# EAGLE board Spartan Edge Accelerator Board v1.0 (EAGLE 6.4), part 1 of 3
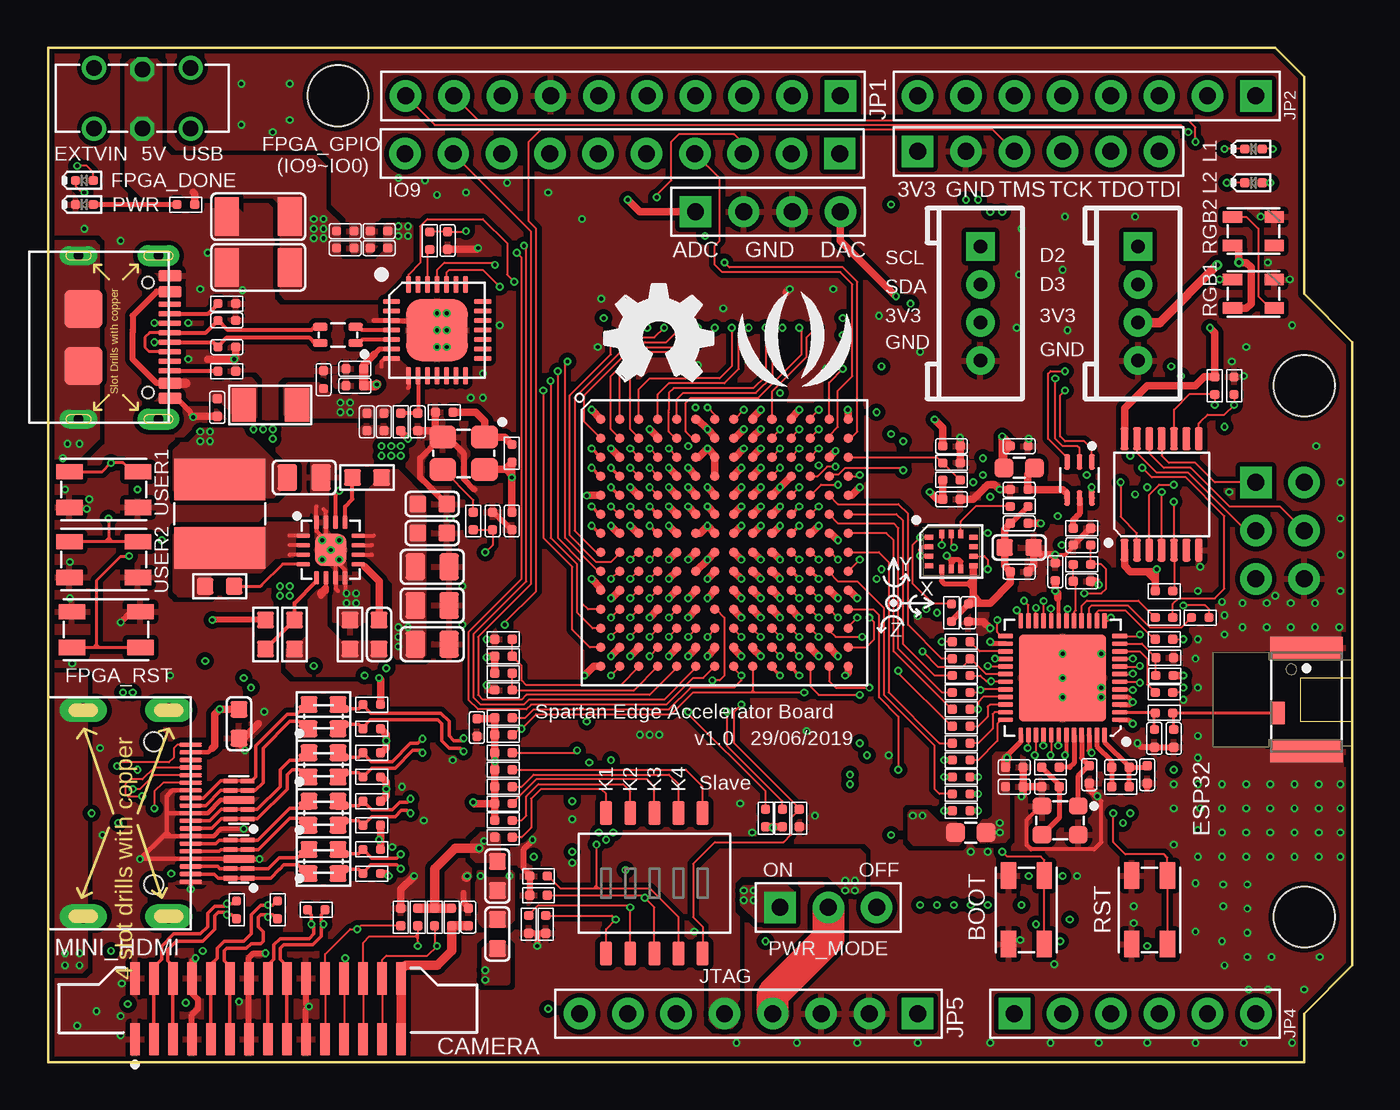
[diagram p8: board, top side]
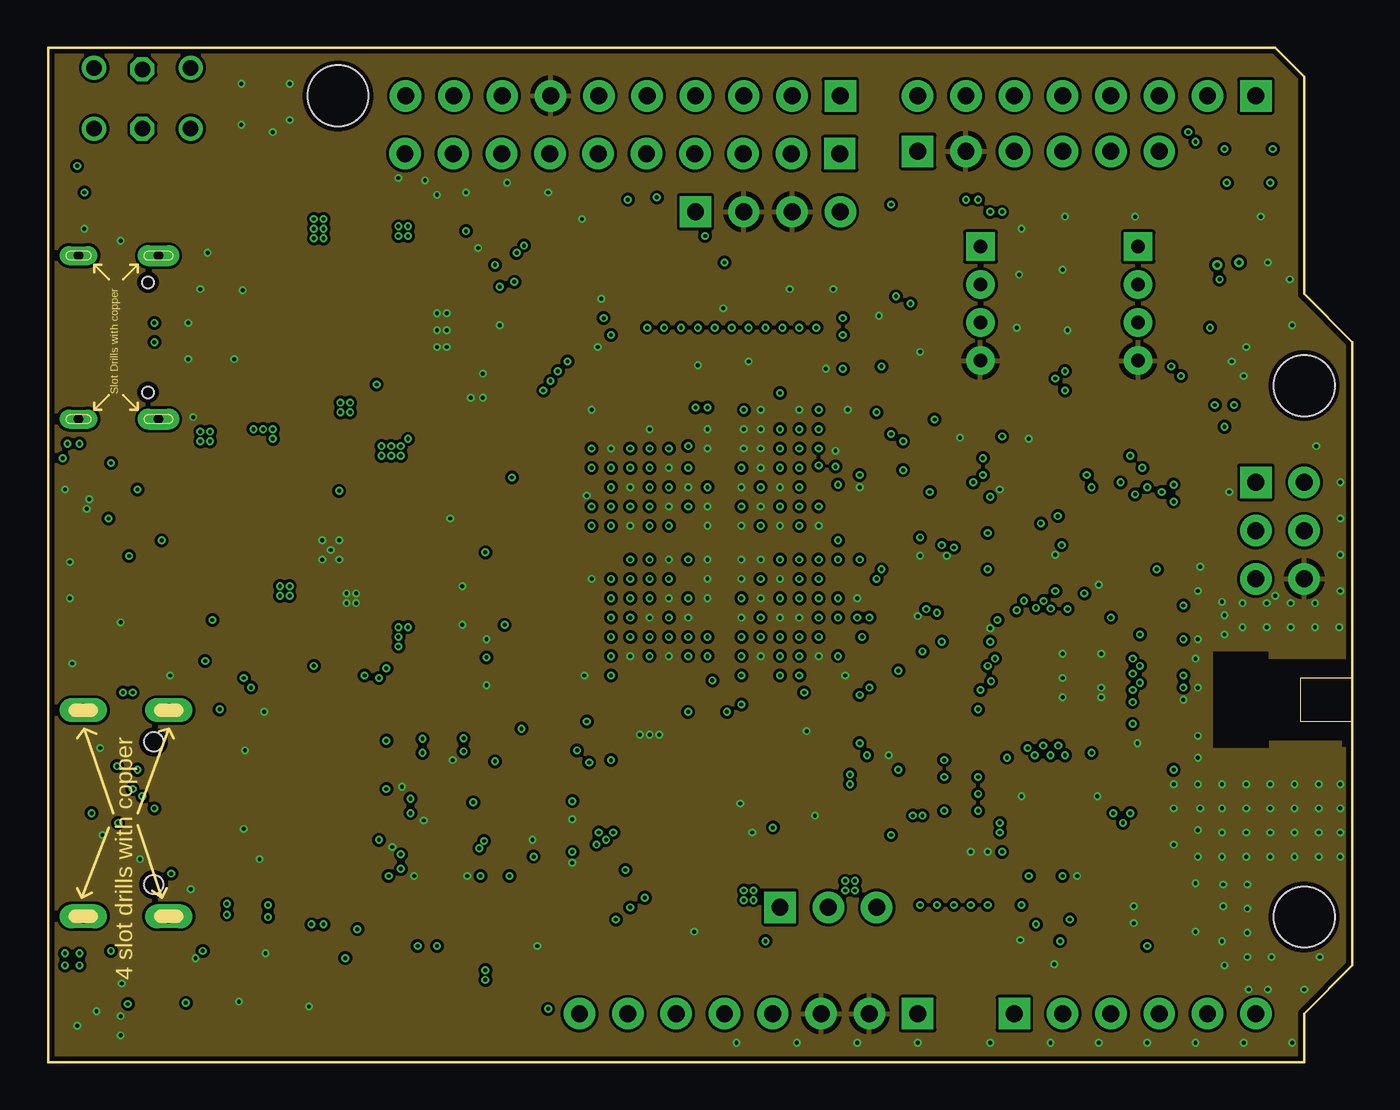
[diagram p9: board, inner layer GND2]
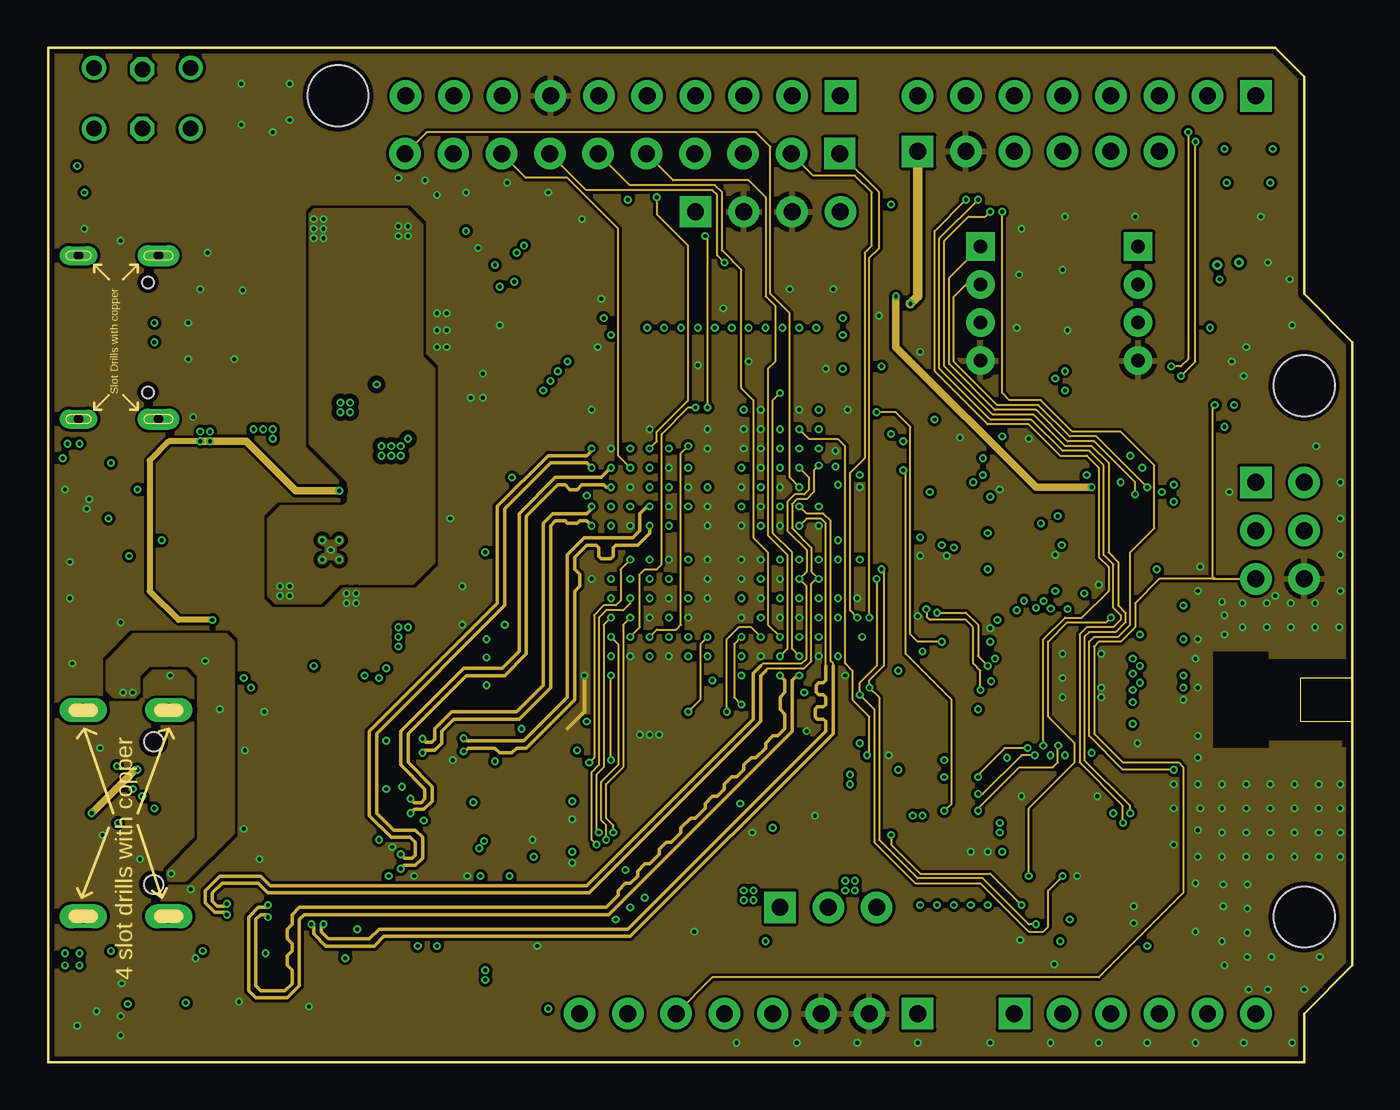
[diagram p10: board, inner layer Route3]
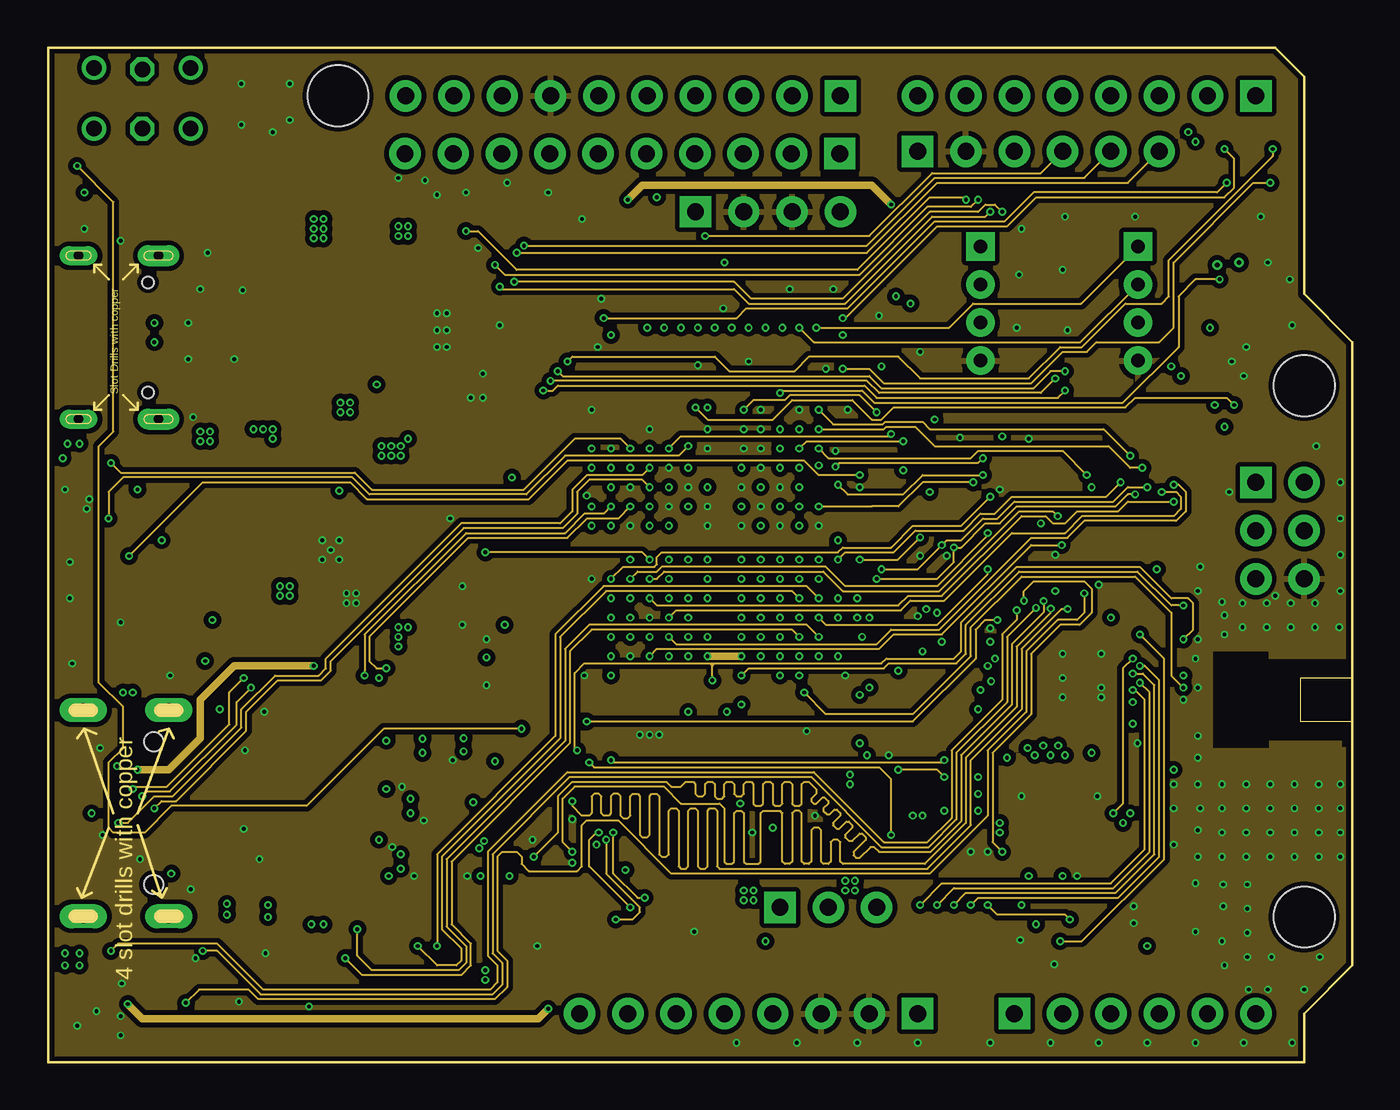
[diagram p11: board, inner layer Route14]
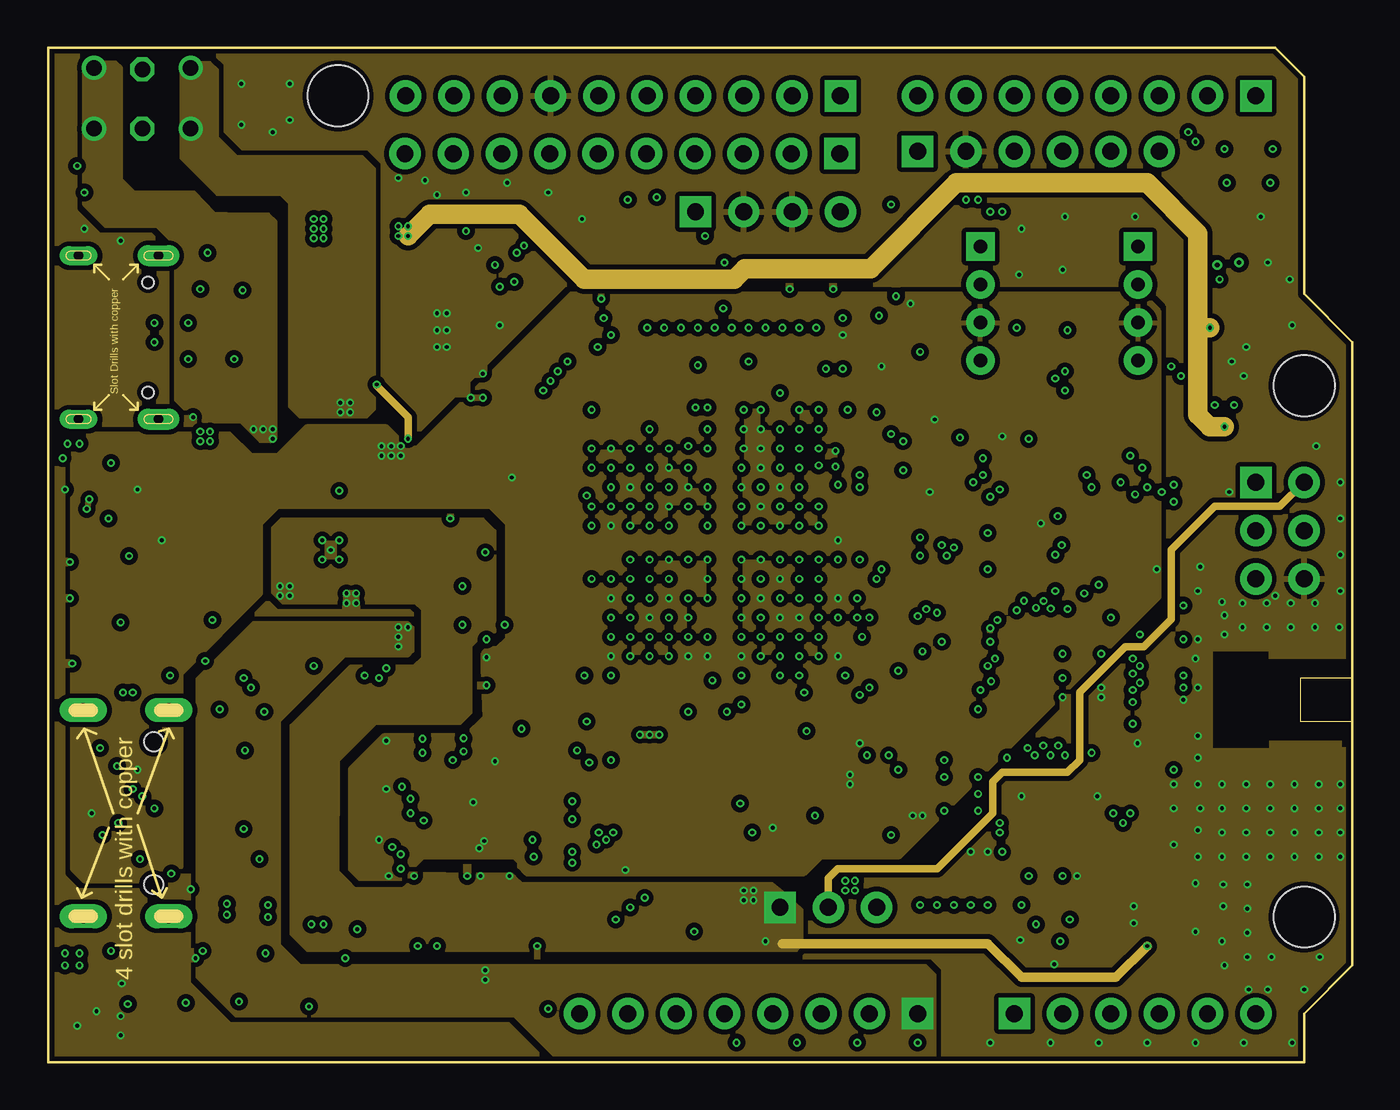
[diagram p12: board, inner layer Route15]
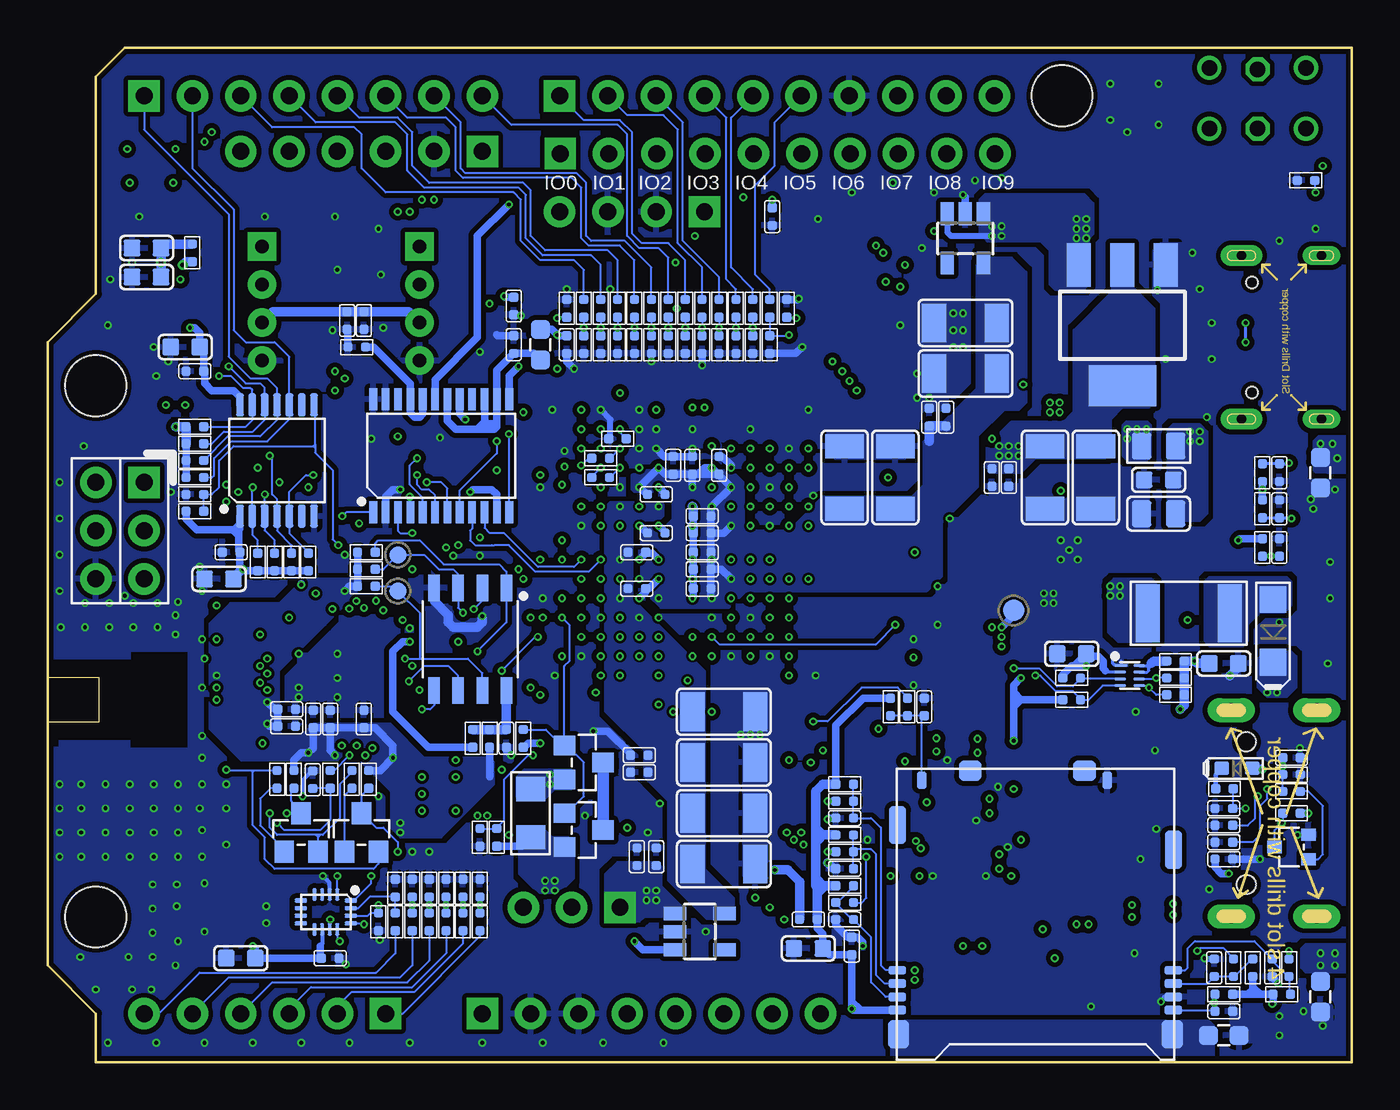
[diagram p13: board, bottom side, seen from below]

Size 68.58 x 53.34 mm. Coordinates in mm from the lower left corner, seen from the top.
Outline: 0,0 66.04,0 66.04,2.54 68.58,5.08 68.58,37.85 66.04,40.39 66.04,51.81 64.51,53.34 0,53.34 0,0
Copper layers (1*2*3*14*15*16): Top 0.035mm / dielectric 0.2mm / GND2 0.0175mm / dielectric 0.3mm / Route3 0.035mm / dielectric 0.2mm / Route14 0.035mm / dielectric 0.15mm / Route15 0.0175mm / dielectric 0.2mm / Bottom 0.035mm
Design rules "SeeedStudio_4layer_DRU_no_angle_20140221 *": minimum track width 1mil, minimum drill 8mil, track to track 4mil, track to pad 4mil, pad to pad 4mil, via to via 4mil, smd to smd 0mil, copper to edge 10mil, drill to drill 8mil, minimum pad ring 4mil, minimum via ring 4mil, stop-mask expansion 4mil, vias tented up to drill 25mil, thermal gap 10mil

## Footprints (pad centres in the part's own frame; a part is rotated, then mirrored left to right if it is on the bottom)
ANT3-SMD-5.2X3.7X0.7MM = smd 1.2 x 0.75: 1 -0.7,1.525 | smd 1.15 x 3.8: 2 -2.725,0; 3 2.725,0
SW4P-SMD-4.5X3.2X2.5MM = smd 1.4 x 0.8: 1 -1.8,-0.94; 2 1.8,-0.94; 3 1.8,0.94; 4 -1.8,0.94
C0402 = smd 0.5 x 0.5: 1 -0.463,0; 2 0.463,0
C0603 = smd 0.889 x 0.889: 1 -0.762,0; 2 0.762,0
C1206 = smd 1.27 x 2.032: 1 -1.651,0; 2 1.651,0
C0805 = smd 1.016 x 1.397: 1 -0.889,0; 2 0.889,0
ESD-0402 = smd 0.5 x 0.5: 1 -0.463,0; 2 0.463,0
LED-0402 = smd 0.5 x 0.5: + 0.463,0; - -0.463,0
SOD-123 = smd 1.397 x 1.397: + 1.651,0; - -1.651,0
SOD-523 = smd 0.762 x 0.7: + 0.8,0; - -0.8,0
F1206 = smd 1.27 x 1.778: 1 -1.397,0; 2 1.397,0
F1812 = smd 1.27 x 3.048: 1 -2.159,0; 2 2.159,0
F0603 = smd 1 x 1: 1 -0.8,0; 2 0.8,0
F0402 = smd 0.5 x 0.5: 1 -0.463,0; 2 0.463,0
F0805 = smd 1.016 x 1.397: 1 -0.889,0; 2 0.889,0
H4-2.54 = drill 0.889 pad 1.651 square: 1 0,3.81 | drill 0.889 pad 1.651: 2 0,1.27; 3 0,-1.27; 4 0,-3.81
HW4-2.0 = drill 0.7 pad 1.5 square: 1 -3,0 | drill 0.7 pad 1.5: 2 -1,0; 3 1,0; 4 3,0
MICRO-SD9+7P-SMD-15X14.5X1.5 = smd 0.914 x 0.457: 1 -7.257,0; 2 -7.257,-0.7; 3 -7.257,-1.4; 4 -7.257,-2.1; 5 7.257,-2.1; 6 7.257,-1.4; 7 7.257,-0.7; 8 7.257,0 | smd 0.508 x 0.889: 9 3.775,9.989; 10 -5.975,9.989 | smd 0.889 x 2.007: 11 -7.25,7.635; 12 7.25,6.335 | smd 1.118 x 1.524: 13 -7.196,-3.365; 14 7.196,-3.365 | smd 1.194 x 1.092: 15 -3.425,10.488; 16 2.575,10.488
H2X3-2.54 = drill 0.889 pad 1.651 square: 1 -1.27,2.54 | drill 0.889 pad 1.651: 2 -1.27,0; 3 -1.27,-2.54; 4 1.27,-2.54; 5 1.27,0; 6 1.27,2.54
H2X15-SMD-1MM = smd 0.5 x 1.7: 1 -7,-1.6; 2 -6,-1.6; 3 -5,-1.6; 4 -4,-1.6; 5 -3,-1.6; 6 -2,-1.6; 7 -1,-1.6; 8 0,-1.6; 9 1,-1.6; 10 2,-1.6; 11 3,-1.6; 12 4,-1.6; 13 5,-1.6; 14 6,-1.6; 15 7,-1.6; 16 -7,1.6; 17 -6,1.6; 18 -5,1.6; 19 -4,1.6; 20 -3,1.6; 21 -2,1.6; 22 -1,1.6; 23 0,1.6; 24 1,1.6; 25 2,1.6; 26 3,1.6; 27 4,1.6; 28 5,1.6; 29 6,1.6; 30 7,1.6
H6-2.54-C65D35MIL = drill 0.889 pad 1.651 square: 1 0,6.35 | drill 0.889 pad 1.651: 2 0,3.81; 3 0,1.27; 4 0,-1.27; 5 0,-3.81; 6 0,-6.35
HDMI-19+4P-0.4-11.2X7.5MM = smd 0.23 x 1.2: 1 -3.6,0; 2 -3.2,0; 3 -2.8,0; 4 -2.4,0; 5 -2,0; 6 -1.6,0; 7 -1.2,0; 8 -0.8,0; 9 -0.4,0; 10 0,0; 11 0.4,0; 12 0.8,0; 13 1.2,0; 14 1.6,0; 15 2,0; 16 2.4,0; 17 2.8,0; 18 3.2,0; 19 3.6,0 | drill 0.7 pad 1.25 long: P1 -5.425,1.15; P2 -5.425,5.65; P3 5.425,5.65; P4 5.425,1.15 | hole 1: 3.75,1.95; -3.75,1.95
H10-2.54 = drill 0.889 pad 1.651 square: 1 0,11.43 | drill 0.889 pad 1.651: 2 0,8.89; 3 0,6.35; 4 0,3.81; 5 0,1.27; 6 0,-1.27; 7 0,-3.81; 8 0,-6.35; 9 0,-8.89; 10 0,-11.43
H3-2.54 = drill 0.889 pad 1.651 square: 1 0,2.54 | drill 0.889 pad 1.651: 2 0,0; 3 0,-2.54
L0402 = smd 0.5 x 0.5: 1 -0.463,0; 2 0.463,0
INT4-0.8-2X1.2MM = smd 0.75 x 0.4: 1 -0.925,-0.4; 2 -0.925,0.4; 3 0.925,0.4; 4 0.925,-0.4
INT2-SMD-4.8X4.8X3MM = smd 2.2 x 4.8: 1 -1.8,0; 2 1.8,0
INT4-0.85-2X1.25X1.2MM = smd 0.4 x 0.75: 1 -0.425,-0.925; 2 -0.425,0.925; 3 0.425,0.925; 4 0.425,-0.925
LED-4P-SMD-2.7X2.4MM = smd 1 x 0.6: 1 1.1,-0.75; 2 1.1,0.75; 3 -1.1,0.75; 4 -1.1,-0.75
SOT-323 = smd 0.762 x 0.635: 1 0.889,-0.635; 2 0.889,0.635; 3 -0.889,0
SOT-23 = smd 1.143 x 1.016: 1 1.016,-0.889; 2 1.016,0.889; 3 -1.016,0
R0402 = smd 0.5 x 0.5: 1 -0.463,0; 2 0.463,0
R0603 = smd 0.889 x 0.889: 1 -0.762,0; 2 0.762,0
R1206 = smd 1.27 x 1.524: 1 -1.27,0; 2 1.27,0
SW6-2.54-9.0X3.5X3.2+2.0MM = drill 0.813 pad 1.27: CH1A -2.54,-1.6; CH1B 2.54,-1.6; CH2A -2.54,1.6; CH2B 2.54,1.6 | drill 0.813 pad 1.27 octagon: COM1 0,-1.6; COM2 0,1.524
MINI-QFN16-0.4-2.6X1.8X0.55MM = smd 0.663 x 0.225: 1 -0.918,0.6; 2 -0.918,0.2; 3 -0.918,-0.2; 4 -0.918,-0.6; 9 0.918,-0.6; 10 0.918,-0.2; 11 0.918,0.2; 12 0.918,0.6 | smd 0.225 x 0.663: 5 -0.6,-1.319; 6 -0.2,-1.319; 7 0.2,-1.319; 8 0.6,-1.319; 13 0.6,1.319; 14 0.2,1.319; 15 -0.2,1.319; 16 -0.6,1.319
10P-SMD-7.95X5.4X2.3MM = smd 0.635 x 1.27: 1 -2.54,-3.683; 2 -1.27,-3.683; 3 0,-3.683; 4 1.27,-3.683; 5 2.54,-3.683; 6 2.54,3.683; 7 1.27,3.683; 8 0,3.683; 9 -1.27,3.683; 10 -2.54,3.683
TP_3535 = smd 0.889 x 0.889: T 0,0
TP-D45MIL = smd 1.143 x 1.143: T 0,0
FTGB196-1.0-15X15X1.46MM = smd 0.5 x 0.5: A1 -6.5,6.5; A2 -5.5,6.5; A3 -4.5,6.5; A4 -3.5,6.5; A5 -2.5,6.5; A6 -1.5,6.5; A7 -0.5,6.5; A8 0.5,6.5; A9 1.5,6.5; A10 2.5,6.5; A11 3.5,6.5; A12 4.5,6.5; A13 5.5,6.5; A14 6.5,6.5; B1 -6.5,5.5; B2 -5.5,5.5; B3 -4.5,5.5; B4 -3.5,5.5; B5 -2.5,5.5; B6 -1.5,5.5; B7 -0.5,5.5; B8 0.5,5.5; B9 1.5,5.5; B10 2.5,5.5; B11 3.5,5.5; B12 4.5,5.5; B13 5.5,5.5; B14 6.5,5.5; C1 -6.5,4.5; C2 -5.5,4.5; C3 -4.5,4.5; C4 -3.5,4.5; C5 -2.5,4.5; C6 -1.5,4.5; C7 -0.5,4.5; C8 0.5,4.5; C9 1.5,4.5; C10 2.5,4.5; C11 3.5,4.5; C12 4.5,4.5; C13 5.5,4.5; C14 6.5,4.5; D1 -6.5,3.5; D2 -5.5,3.5; D3 -4.5,3.5; D4 -3.5,3.5; D5 -2.5,3.5; D6 -1.5,3.5; D7 -0.5,3.5; D8 0.5,3.5; D9 1.5,3.5; D10 2.5,3.5; D11 3.5,3.5; D12 4.5,3.5; D13 5.5,3.5; D14 6.5,3.5; E1 -6.5,2.5; E2 -5.5,2.5; E3 -4.5,2.5; E4 -3.5,2.5; E5 -2.5,2.5; E6 -1.5,2.5; E7 -0.5,2.5; E8 0.5,2.5; E9 1.5,2.5; E10 2.5,2.5; E11 3.5,2.5; E12 4.5,2.5; E13 5.5,2.5; E14 6.5,2.5; F1 -6.5,1.5; F2 -5.5,1.5; F3 -4.5,1.5; F4 -3.5,1.5; F5 -2.5,1.5; F6 -1.5,1.5; F7 -0.5,1.5; F8 0.5,1.5; F9 1.5,1.5; F10 2.5,1.5; F11 3.5,1.5; F12 4.5,1.5; F13 5.5,1.5; F14 6.5,1.5; G1 -6.5,0.5; G2 -5.5,0.5; G3 -4.5,0.5; G4 -3.5,0.5; G5 -2.5,0.5; G6 -1.5,0.5; G7 -0.5,0.5; G8 0.5,0.5; G9 1.5,0.5; G10 2.5,0.5; G11 3.5,0.5; G12 4.5,0.5; G13 5.5,0.5; G14 6.5,0.5; H1 -6.5,-0.5; H2 -5.5,-0.5; H3 -4.5,-0.5; H4 -3.5,-0.5; H5 -2.5,-0.5; H6 -1.5,-0.5; H7 -0.5,-0.5; H8 0.5,-0.5; H9 1.5,-0.5; H10 2.5,-0.5; H11 3.5,-0.5; H12 4.5,-0.5; H13 5.5,-0.5; H14 6.5,-0.5; J1 -6.5,-1.5; J2 -5.5,-1.5; J3 -4.5,-1.5; J4 -3.5,-1.5; J5 -2.5,-1.5; J6 -1.5,-1.5; J7 -0.5,-1.5; J8 0.5,-1.5; J9 1.5,-1.5; J10 2.5,-1.5; J11 3.5,-1.5; J12 4.5,-1.5; J13 5.5,-1.5; J14 6.5,-1.5; K1 -6.5,-2.5; K2 -5.5,-2.5; K3 -4.5,-2.5; K4 -3.5,-2.5; K5 -2.5,-2.5; K6 -1.5,-2.5; K7 -0.5,-2.5; K8 0.5,-2.5; K9 1.5,-2.5; K10 2.5,-2.5; K11 3.5,-2.5; K12 4.5,-2.5; K13 5.5,-2.5; K14 6.5,-2.5; L1 -6.5,-3.5; L2 -5.5,-3.5; L3 -4.5,-3.5; L4 -3.5,-3.5; L5 -2.5,-3.5; L6 -1.5,-3.5; L7 -0.5,-3.5; L8 0.5,-3.5; L9 1.5,-3.5; L10 2.5,-3.5; L11 3.5,-3.5; L12 4.5,-3.5; L13 5.5,-3.5; L14 6.5,-3.5; M1 -6.5,-4.5; M2 -5.5,-4.5; M3 -4.5,-4.5; M4 -3.5,-4.5; M5 -2.5,-4.5; M6 -1.5,-4.5; M7 -0.5,-4.5; M8 0.5,-4.5; M9 1.5,-4.5; M10 2.5,-4.5; M11 3.5,-4.5; M12 4.5,-4.5; M13 5.5,-4.5; M14 6.5,-4.5; N1 -6.5,-5.5; N2 -5.5,-5.5; N3 -4.5,-5.5; N4 -3.5,-5.5; N5 -2.5,-5.5; N6 -1.5,-5.5; N7 -0.5,-5.5; N8 0.5,-5.5; N9 1.5,-5.5; N10 2.5,-5.5; N11 3.5,-5.5; N12 4.5,-5.5; N13 5.5,-5.5; N14 6.5,-5.5; P1 -6.5,-6.5; P2 -5.5,-6.5; P3 -4.5,-6.5; P4 -3.5,-6.5; P5 -2.5,-6.5; P6 -1.5,-6.5; P7 -0.5,-6.5; P8 0.5,-6.5; P9 1.5,-6.5; P10 2.5,-6.5; P11 3.5,-6.5; P12 4.5,-6.5; P13 5.5,-6.5; P14 6.5,-6.5
QFN48G-0.4-6X6MM = smd 0.25 x 0.8: 1 -2.2,-3; 2 -1.8,-3; 3 -1.4,-3; 4 -1,-3; 5 -0.6,-3; 6 -0.2,-3; 7 0.2,-3; 8 0.6,-3; 9 1,-3; 10 1.4,-3; 11 1.8,-3; 12 2.2,-3; 25 2.2,3; 26 1.8,3; 27 1.4,3; 28 1,3; 29 0.6,3; 30 0.2,3; 31 -0.2,3; 32 -0.6,3; 33 -1,3; 34 -1.4,3; 35 -1.8,3; 36 -2.2,3 | smd 0.8 x 0.25: 13 3,-2.2; 14 3,-1.8; 15 3,-1.4; 16 3,-1; 17 3,-0.6; 18 3,-0.2; 19 3,0.2; 20 3,0.6; 21 3,1; 22 3,1.4; 23 3,1.8; 24 3,2.2; 37 -3,2.2; 38 -3,1.8; 39 -3,1.4; 40 -3,1; 41 -3,0.6; 42 -3,0.2; 43 -3,-0.2; 44 -3,-0.6; 45 -3,-1; 46 -3,-1.4; 47 -3,-1.8; 48 -3,-2.2 | smd 4.6 x 4.6: PAD 0,0
SOIC8-1.27-5X4MM = smd 0.6 x 1.4: 1 -1.905,-2.7; 2 -0.635,-2.7; 3 0.635,-2.7; 4 1.905,-2.7; 5 1.905,2.7; 6 0.635,2.7; 7 -0.635,2.7; 8 -1.905,2.7
TSSOP24-0.65-7.8X4.4MM = smd 0.4 x 1.15: 1 -3.575,-2.973; 2 -2.925,-2.973; 3 -2.275,-2.973; 4 -1.625,-2.973; 5 -0.975,-2.973; 6 -0.325,-2.973; 7 0.325,-2.973; 8 0.975,-2.973; 9 1.625,-2.973; 10 2.275,-2.973; 11 2.925,-2.973; 12 3.575,-2.973; 13 3.575,2.973; 14 2.925,2.973; 15 2.275,2.973; 16 1.625,2.973; 17 0.975,2.973; 18 0.325,2.973; 19 -0.325,2.973; 20 -0.975,2.973; 21 -1.625,2.973; 22 -2.275,2.973; 23 -2.925,2.973; 24 -3.575,2.973
QFN28 = smd 0.9 x 0.25: 1 -2.4,1.5; 2 -2.4,1; 3 -2.4,0.5; 4 -2.4,0; 5 -2.4,-0.5; 6 -2.4,-1; 7 -2.4,-1.5; 15 2.4,-1.5; 16 2.4,-1; 17 2.4,-0.5; 18 2.4,0; 19 2.4,0.5; 20 2.4,1; 21 2.4,1.5 | smd 0.25 x 0.9: 8 -1.5,-2.4; 9 -1,-2.4; 10 -0.5,-2.4; 11 0,-2.4; 12 0.5,-2.4; 13 1,-2.4; 14 1.5,-2.4; 22 1.5,2.4; 23 1,2.4; 24 0.5,2.4; 25 0,2.4; 26 -0.5,2.4; 27 -1,2.4; 28 -1.5,2.4 | smd 3.25 x 3.25: PAD 0,0
SC-70-6 = smd 0.3 x 0.8: 1 -0.65,-0.95; 2 0,-0.95; 3 0.65,-0.95; 4 0.65,0.95; 5 0,0.95; 6 -0.65,0.95
SOT-223 = smd 1.27 x 2.286: 1 -2.286,-3.175; 2 0,-3.175; 3 2.286,-3.175 | smd 3.556 x 2.159: TER 0,3.175
SOT-23-5 = smd 0.69 x 1.2: 1 -0.95,-1.3; 2 0,-1.3; 3 0.95,-1.3; 4 0.95,1.3; 5 -0.95,1.3
ARDUINO-32P = drill 0.889 pad 1.651 square: 1 63.5,50.8; 9 41.656,50.8; 19 50.8,2.54; 25 45.72,2.54 | drill 0.889 pad 1.651: 2 60.96,50.8; 3 58.42,50.8; 4 55.88,50.8; 5 53.34,50.8; 6 50.8,50.8; 7 48.26,50.8; 8 45.72,50.8; 10 39.116,50.8; 11 36.576,50.8; 12 34.036,50.8; 13 31.496,50.8; 14 28.956,50.8; 15 26.416,50.8; 16 23.876,50.8; 17 21.336,50.8; 18 18.796,50.8; 20 53.34,2.54; 21 55.88,2.54; 22 58.42,2.54; 23 60.96,2.54; 24 63.5,2.54; 26 43.18,2.54; 27 40.64,2.54; 28 38.1,2.54; 29 35.56,2.54; 30 33.02,2.54; 31 30.48,2.54; 32 27.94,2.54 | hole 3.2: 15.24,50.8; 66.04,35.56; 66.04,7.62
VQFN16-0.5-3X3X1MM = smd 0.24 x 0.7: 1 -0.75,-1.45; 2 -0.25,-1.45; 3 0.25,-1.45; 4 0.75,-1.45; 9 0.75,1.45; 10 0.25,1.45; 11 -0.25,1.45; 12 -0.75,1.45 | smd 0.7 x 0.24: 5 1.45,-0.75; 6 1.45,-0.25; 7 1.45,0.25; 8 1.45,0.75; 13 -1.45,0.75; 14 -1.45,0.25; 15 -1.45,-0.25; 16 -1.45,-0.75 | smd 1.68 x 1.68: PAD 0,0
LGA14L_DOT_INDICATOR = smd 0.25 x 0.45: 1 -0.75,-1.175; 2 -0.25,-1.175; 3 0.25,-1.175; 4 0.75,-1.175; 8 0.75,1.175; 9 0.25,1.175; 10 -0.25,1.175; 11 -0.75,1.175 | smd 0.45 x 0.25: 5 0.925,-0.5; 6 0.925,0; 7 0.925,0.5; 12 -0.925,0.5; 13 -0.925,0; 14 -0.925,-0.5
X2SON8-0.35-1.4X1X0.37MM = smd 0.16 x 0.7: 1 -0.525,-0.45 | smd 0.16 x 0.6: 2 -0.175,-0.5; 3 0.175,-0.5; 4 0.525,-0.5; 5 0.525,0.5; 6 0.175,0.5; 7 -0.175,0.5; 8 -0.525,0.5
ESD10P-0.5-2.5X1X0.58MM = smd 0.25 x 0.7: 1 -1,-0.45; 2 -0.5,-0.45; 4 0.5,-0.45; 5 1,-0.45; 6 1,0.45; 7 0.5,0.45; 9 -0.5,0.45; 10 -1,0.45 | smd 0.4 x 0.7: 3 0,-0.45 | smd 0.4 x 0.9: 8 0,0.35
TSSOP14-0.65-5X4.4MM = smd 0.4 x 1.2: 1 -1.95,-2.925; 2 -1.3,-2.925; 3 -0.65,-2.925; 4 0,-2.925; 5 0.65,-2.925; 6 1.3,-2.925; 7 1.95,-2.925; 8 1.95,2.925; 9 1.3,2.925; 10 0.65,2.925; 11 0,2.925; 12 -0.65,2.925; 13 -1.3,2.925; 14 -1.95,2.925
USB2.0-TYPE-C = smd 1.2 x 0.6: A1_B12 0.05,3.25; A4_B9 0.05,2.4; B1_A12 0.05,-3.2; B4_A9 0.05,-2.4 | smd 1.2 x 0.3: A5 0.05,1.25; A6 0.05,0.25; A7 0.05,-0.25; A8 0.05,-1.25; B5 0.05,-1.75; B6 0.05,-0.75; B7 0.05,0.75; B8 0.05,1.75 | drill 0.5 pad 1 long: S1 -4.75,4.3; S2 -4.75,-4.3 | drill 0.5 pad 1.1 long: S3 -0.55,4.3; S4 -0.55,-4.3 | smd 2 x 2: S5 -4.5,1.5; S6 -4.5,-1.5 | hole 0.6: -1.1,-2.89; -1.1,2.89
X4-SMD-3.2X2.5X1MM = smd 1.4 x 1.2: 1 -1.1,-0.85; 2 1.1,-0.85; 3 1.1,0.85; 4 -1.1,0.85
X4-SMD-2.5X2.0X1.0MM = smd 1 x 0.9: 1 -0.95,-0.75; 2 0.95,-0.75; 3 0.95,0.75; 4 -0.95,0.75

## Placement (x,y rotation side)
ANT1  ACA-5036  [ANT3-SMD-5.2X3.7X0.7MM]  66.17,19.05 90 top
BOOT  SKRPABE010  [SW4P-SMD-4.5X3.2X2.5MM]  51.44,8 90 top
BUTTON1  BUTTON  [SW4P-SMD-4.5X3.2X2.5MM]  2.92,30.1 180 top
BUTTON2  BUTTON  [SW4P-SMD-4.5X3.2X2.5MM]  2.92,26.42 180 top
C1  1uF  [C0402]  14.48,35.88 270 top
C2  10pF  [C0402]  52.7,14.48 0 top
C3  10pF  [C0402]  54.74,15.11 90 top
C4  100nF  [C0402]  51.94,18.03 90 bottom
C5  100nF  [C0402]  53.72,18.03 90 bottom
C6  100nF  [C0402]  54.61,18.03 90 bottom
C7  100nF  [C0402]  52.96,25.78 90 top
C8  100nF  [C0402]  56.01,18.54 0 bottom
C9  100nF  [C0402]  56.01,17.65 0 bottom
C10  1uF  [C0402]  15.62,42.8 0 top
C11  1uF  [C0402]  15.62,43.69 0 top
C12  100nF  [C0402]  22.1,7.62 90 top
C13  1uF  [C0402]  19.43,33.66 90 top
C14  1uF  [C0402]  17.65,33.66 90 top
C15  100nF  [C0402]  16.76,33.66 90 top
C16  1uF  [C0402]  16.13,35.56 0 top
C17  100nF  [C0402]  16.13,36.45 0 top
C18  100nF  [C0603]  6.73,20.95 180 bottom
C20  3.3nF  [C0402]  56.39,15.49 180 top
C21  10nF  [C0402]  57.78,15.11 270 top
C22  1uF  [C0402]  50.8,14.48 0 top
C23  1uF  [C0402]  50.8,15.49 0 top
C24  100nF  [C0402]  44.45,17.02 270 bottom
C25  1uF  [C0402]  41.27,37.72 270 bottom
C26  1uF  [C0402]  44.07,37.72 90 bottom
C27  1uF  [C0402]  47.5,29.59 0 top
C28  1uF  [C0402]  47.5,32.38 0 top
C29  1uF  [C0402]  51.05,30.1 180 top
C30  1uF  [C0402]  51.05,32.38 0 top
C31  1uF  [C0402]  35.69,31.37 90 bottom
C32  1uF  [C0402]  34.67,31.37 90 bottom
C33  1uF  [C0402]  36.58,29.84 0 bottom
C34  1uF  [C0402]  34.16,28.7 180 bottom
C35  1uF  [C0402]  36.58,27.81 0 bottom
C36  1uF  [C0402]  33.27,31.37 90 bottom
C37  1uF  [C0402]  34.16,25.91 180 bottom
C38  1uF  [C0402]  34.16,27.81 180 bottom
C39  1uF  [C0402]  34.16,26.8 180 bottom
C40  22uF  [C1206]  33.02,18.41 0 bottom
C41  22uF  [C1206]  26.67,30.73 90 bottom
C42  22uF  [C1206]  33.02,15.75 0 bottom
C43  470nF  [C0402]  37.59,24.89 0 bottom
C44  470nF  [C0402]  37.59,26.8 0 bottom
C45  22uF  [C1206]  24,30.73 90 bottom
C46  470nF  [C0402]  34.16,24.89 180 bottom
C47  10uF  [C0805]  20.19,21.97 180 top
C48  22uF  [C1206]  13.46,30.73 90 bottom
C49  22uF  [C1206]  16.13,30.73 90 bottom
C50  1uF  [C0402]  18.03,30.73 270 bottom
C51  1uF  [C0402]  18.92,30.73 270 bottom
C52  22uF  [C1206]  20.32,38.86 0 bottom
C53  33nF  [C0603]  17.4,22.48 90 top
C54  33nF  [C0603]  20.19,27.81 180 top
C55  10uF  [C0805]  20.19,26.04 180 top
C56  10uF  [C0805]  20.19,24 180 top
C57  100nF  [C0603]  20.19,29.34 180 top
C58  22uF  [C1206]  20.32,36.2 0 bottom
C59  1uF  [C0402]  21.34,33.91 90 bottom
C60  1uF  [C0402]  22.23,33.91 90 bottom
C61  22uF  [C1206]  33.02,10.41 180 bottom
C62  22uF  [C1206]  33.02,13.08 180 bottom
C63  1uF  [C0402]  37.47,16.13 180 bottom
C64  1uF  [C0402]  37.47,15.24 180 bottom
C65  1uF  [C0402]  37.59,10.79 90 bottom
C66  1uF  [C0402]  36.58,10.79 90 bottom
C67  1uF  [C0402]  17.4,42.8 180 top
C68  1uF  [C0402]  17.4,43.69 180 top
C69  22uF  [C1206]  11.05,44.45 0 top
C70  22uF  [C1206]  11.05,41.78 0 top
C71  DNP  [C0402]  23.37,28.45 90 top
C72  100nF  [C0402]  24.38,28.45 270 top
C73  100nF  [C0402]  22.54,17.59 270 top
C74  10uF  [C0805]  13.46,30.73 180 top
C75  1uF  [C0402]  52.83,38.99 270 bottom
C76  10uF  [C0805]  10.16,28.83 0 bottom
C77  100nF  [C0603]  10.16,30.61 0 bottom
C78  100nF  [C0402]  51.94,38.99 270 bottom
C79  DNP  [C0402]  54.36,27.18 180 top
C80  DNP  [C0402]  54.36,25.27 0 top
C81  100nF  [C0402]  26.29,6.1 90 bottom
C82  10uF  [C0603]  28.57,5.97 0 bottom
C83  DNP  [C0402]  54.64,14.84 90 bottom
C84  100nF  [C0402]  51.05,25.78 0 top
C85  100nF  [C0603]  14.73,21.46 0 bottom
C86  DNP  [C0402]  44.07,39.75 270 bottom
C87  DNP  [C0402]  30.48,44.45 270 bottom
C90  DNP  [C0603]  23.62,9.78 90 top
C91  4.7uF  [C0603]  63.37,41.27 0 bottom
C92  4.7uF  [C0603]  63.37,42.8 0 bottom
C93  DNP  [C0603]  23.62,6.73 270 top
C94  100nF  [C0603]  10.03,17.78 90 top
C95  DNP  [C0402]  3.81,27.05 90 bottom
C96  DNP  [C0402]  3.81,30.99 270 bottom
C97  DNP  [C0603]  51.05,27.05 180 top
C98  DNP  [C0402]  3.81,29.08 90 bottom
C99  100nF  [C0402]  48.39,23.62 270 top
C100  DNP  [C0402]  21,43.2 270 top
C101  100nF  [C0402]  60.83,36.32 0 bottom
C102  10uF  [C0603]  61.34,37.59 180 bottom
C103  100nF  [C0402]  53.72,5.46 180 bottom
C104  10uF  [C0603]  58.42,5.46 180 bottom
C105  100nF  [C0402]  58.93,26.8 180 bottom
C106  10uF  [C0603]  59.56,25.4 0 bottom
D1  ESDPSA0402V05  [ESD-0402]  9.4,38.99 180 top
D2  ESDPSA0402V05  [ESD-0402]  9.4,37.59 180 top
D3  Green  [LED-0402]  1.91,45.09 0 top
D4  RB160M-60TR  [SOD-123]  4.14,22.67 90 bottom
D5  ESDPSA0402V05  [ESD-0402]  3.17,16 180 bottom
D6  ESDPSA0402V05  [ESD-0402]  6.73,10.67 180 bottom
D7  ESDPSA0402V05  [ESD-0402]  6.73,12.45 0 bottom
D8  ESDPSA0402V05  [ESD-0402]  6.73,11.56 0 bottom
D9  ESDPSA0402V05  [ESD-0402]  6.73,13.34 0 bottom
D10  BAS16XV2T1G  [SOD-523]  6.04,15.43 0 bottom
D11  ESDPSA0402V05  [ESD-0402]  22.48,18.67 270 bottom
D12  ESDPSA0402V05  [ESD-0402]  26.67,12.83 0 bottom
D13  ESDPSA0402V05  [ESD-0402]  26.67,10.16 0 bottom
D14  ESDPSA0402V05  [ESD-0402]  26.67,7.49 0 bottom
D15  ESDPSA0402V05  [ESD-0402]  6.73,2.67 180 bottom
D16  ESDPSA0402V05  [ESD-0402]  7.24,4.95 270 bottom
D17  ESDPSA0402V05  [ESD-0402]  4.19,4.95 90 bottom
D18  Green  [LED-0402]  63.37,48.01 0 top
D19  Red  [LED-0402]  63.37,46.23 0 top
D20  Red  [LED-0402]  1.91,46.35 0 top
D21  ESDPSA0402V05  [ESD-0402]  8.89,34.42 270 top
F1  1000mA  [F1206]  11.68,34.54 180 top
F2  1812L160/12  [F1812]  8.57,23.59 180 bottom
FB1  220R/2A  [F0603]  48.51,12.06 180 top
FB2  220R/2A  [F0603]  42.67,37.72 270 bottom
FB3  220R/2A  [F0603]  51.05,31.24 180 top
FB4  120R/1.3A  [F0402]  28.57,7.49 0 bottom
FB5  120R/1.3A  [F0402]  51.05,28.32 180 top
FB6  BLM21PG331SN1D  [F0805]  10.16,32.38 180 bottom
FB7  120R/2A  [F0603]  1.65,3.43 90 bottom
FB8  120R/2A  [F0603]  1.65,30.99 270 bottom
FB9  120R/2A  [F0603]  6.73,1.4 0 bottom
FPGA_RST  BUTTON  [SW4P-SMD-4.5X3.2X2.5MM]  3.05,22.73 0 top
FR1  SEEEDSTUDIO-OPEN-SCH-FRAME-BIG  [SEEEDSTUDIO-PCB-FRAME]  -4.19,-11.05 0 top  (outside the outline)
FR2  SEEEDSTUDIO-OPEN-SCH-FRAME-BIG  [SEEEDSTUDIO-PCB-FRAME]  -4.19,-17.65 0 top  (outside the outline)
FR3  SEEEDSTUDIO-OPEN-SCH-FRAME-BIG  [SEEEDSTUDIO-PCB-FRAME]  -4.19,-24.13 0 top  (outside the outline)
FR4  SEEEDSTUDIO-OPEN-SCH-FRAME-BIG  [SEEEDSTUDIO-PCB-FRAME]  -4.19,-31.24 0 top  (outside the outline)
FR5  SEEEDSTUDIO-OPEN-SCH-FRAME-BIG  [SEEEDSTUDIO-PCB-FRAME]  -4.19,-38.86 0 top  (outside the outline)
FR6  SEEEDSTUDIO-OPEN-SCH-FRAME-BIG  [SEEEDSTUDIO-PCB-FRAME]  -4.19,-46.35 0 top  (outside the outline)
J1  4PIN-2.54  [H4-2.54]  37.85,44.7 90 top
J2  320110033  [HW4-2.0]  57.31,39.88 270 top
J3  SCHA5B0200  [MICRO-SD9+7P-SMD-15X14.5X1.5]  16.64,4.83 0 bottom
J4  320110033  [HW4-2.0]  49.02,39.88 270 top
J5  2*3pin  [H2X3-2.54]  64.77,27.94 0 top
J6  FPC 15pins  [H2X15-SMD-1MM]  11.56,2.79 0 top
J8  6PIN-2.54  [H6-2.54-C65D35MIL]  52.07,47.88 90 top
J9  Mini HDMI  [HDMI-19+4P-0.4-11.2X7.5MM]  7.49,13.08 90 top
J10  DNP  [H10-2.54]  30.19,47.76 270 top
J15  [H3-2.54]  41.02,8.13 90 top
L1  DNP  [L0402]  58.17,17.02 90 top
L2  DNP  [L0402]  59.18,17.02 90 top
L3  DNP  [INT4-0.8-2X1.2MM]  14.48,10.54 0 top
L4  DNP  [INT4-0.8-2X1.2MM]  14.48,13.08 0 top
L5  DNP  [INT4-0.8-2X1.2MM]  14.48,15.62 0 top
L6  VLC5045T-2R2N  [INT2-SMD-4.8X4.8X3MM]  9.02,28.83 90 top
L7  DNP  [INT4-0.8-2X1.2MM]  14.48,18.16 0 top
L15  SRF2012-900YA  [INT4-0.85-2X1.25X1.2MM]  15.24,38.23 90 top
LED1  SK6805  [LED-4P-SMD-2.7X2.4MM]  63.37,40.39 0 top
LED2  SK6805  [LED-4P-SMD-2.7X2.4MM]  63.37,43.69 0 top
Q1  CJ2102  [SOT-323]  3.17,11.3 0 bottom
Q2  CJ3407  [SOT-23]  40.39,15.75 180 bottom
Q3  CJ3407  [SOT-23]  40.39,12.19 180 bottom
Q4  MMBT3904  [SOT-23]  55.24,12.06 270 bottom
Q5  MMBT3904  [SOT-23]  52.07,12.06 270 bottom
R1  20k  [R0402]  56.39,14.48 180 top
R2  DNP  [R0402]  46.23,17.02 270 bottom
R3  0R  [R0402]  45.34,17.02 270 bottom
R4  10k  [R0402]  51.69,14.86 90 bottom
R5  10k  [R0402]  55.63,14.86 90 bottom
R6  0R  [R0402]  52.32,37.59 0 bottom
R7  0R  [R0402]  54.36,28.07 0 top
R8  4.7k  [R0402]  18.54,33.66 270 top
R9  10k  [R0402]  56.52,14.86 90 bottom
R10  33R  [R0402]  20.07,43.18 270 top
R11  0R  [R0603]  15.88,22.48 90 top
R12  33R  [R0402]  53.72,14.86 270 bottom
R13  10k  [R0402]  7.24,45.09 180 top
R14  10k  [R0402]  52.58,14.86 90 bottom
R15  5.1k  [R0402]  9.4,36.32 0 top
R16  0R  [R0402]  22.35,28.45 270 top
R17  DNP  [R0402]  23.94,21.34 180 top
R18  10k  [R0402]  23.94,20.45 180 top
R19  10k  [R0402]  23.94,22.23 0 top
R20  DNP  [R0402]  23.94,19.56 0 top
R21  4.7k  [R0402]  3.17,13.08 0 bottom
R22  5.1k  [R0402]  9.4,39.88 0 top
R23  0R  [R0402]  58.67,22.23 0 top
R24  0R  [R0402]  48.01,22.1 180 top
R25  0R  [R0402]  60.58,23.37 0 top
R26  0R  [R0402]  58.67,19.43 0 top
R27  0R  [R0402]  58.67,23.37 0 top
R28  100R  [R0402]  48.01,21.21 0 top
R29  100R  [R0402]  48.01,20.32 0 top
R30  2k  [R0402]  19.43,7.62 90 top
R31  2k  [R0402]  20.32,7.62 90 top
R32  10k  [R0402]  45.85,7.37 270 bottom
R33  20k  [R0402]  45.85,9.14 90 bottom
R34  10k  [R0402]  46.74,7.37 270 bottom
R35  20k  [R0402]  46.74,9.14 90 bottom
R36  10k  [R0402]  47.62,7.37 270 bottom
R37  0R  [R0402]  21.21,7.62 90 top
R38  DNP  [R0402]  18.54,7.62 90 top
R39  200k  [R0402]  9.27,21.08 180 bottom
R40  4.7k  [R0402]  9.27,20.19 180 bottom
R41  4.7k  [R0402]  9.27,19.3 180 bottom
R42  4.7k  [R0402]  14.73,20.19 0 bottom
R43  4.7k  [R0402]  14.73,19.05 0 bottom
R44  2k  [R0402]  41.27,39.62 270 bottom
R45  2k  [R0402]  29.72,39.62 270 bottom
R46  2k  [R0402]  2.41,46.35 0 bottom
R47  0R  [R0402]  52.7,15.49 180 top
R48  10k  [R0402]  43.56,17.02 270 bottom
R49  1k  [R0402]  44.96,11.81 90 bottom
R50  1k  [R0402]  24.38,32 270 top
R51  1k  [R0402]  23.94,14.48 0 top
R52  1k  [R0402]  23.94,13.59 0 top
R53  4.7k  [R0402]  23.94,16.26 0 top
R54  4.7k  [R0402]  23.94,18.1 0 top
R55  4.7k  [R0402]  23.94,17.21 0 top
R56  1k  [R0402]  38.61,12.83 90 top
R57  1k  [R0402]  37.72,12.83 90 top
R58  0R  [R0402]  58.67,18.35 180 top
R59  100k  [R0402]  25.78,9.78 180 top
R60  100k  [R0402]  25.78,8.76 180 top
R61  100k  [R0603]  9.02,25.02 180 top
R62  0R  [R0603]  16.76,30.73 180 top
R63  100k  [R0402]  25.27,7.24 270 top
R64  100k  [R0402]  26.16,7.24 270 top
R65  1k  [R0402]  38.61,32.77 180 bottom
R66  0R  [R0402]  60.96,42.55 90 bottom
R67  10k  [R0402]  3.17,15.11 180 bottom
R68  100R  [R0402]  48.01,19.43 0 top
R69  100R  [R0402]  48.01,18.54 0 top
R70  1k  [R0402]  3.17,14.22 0 bottom
R71  10k  [R0402]  45.85,11.81 90 bottom
R72  49.9R  [R0402]  17.02,9.91 180 top
R73  49.9R  [R0402]  17.02,11.18 180 top
R74  49.9R  [R0402]  17.02,12.45 180 top
R75  49.9R  [R0402]  17.02,13.72 180 top
R76  49.9R  [R0402]  17.02,14.99 180 top
R77  49.9R  [R0402]  17.02,16.26 180 top
R78  49.9R  [R0402]  17.02,17.53 180 top
R79  49.9R  [R0402]  17.02,18.8 180 top
R80  100nF  [R0603]  14.48,9.91 0 top
R81  100nF  [R0603]  14.48,11.18 0 top
R82  1k  [R0402]  23.94,15.37 0 top
R83  1k  [R0402]  23.94,12.7 0 top
R84  33R  [R0402]  48.01,16.76 0 top
R85  10k  [R0402]  24.26,18.67 90 bottom
R86  100nF  [R0603]  14.48,12.45 0 top
R87  100nF  [R0603]  14.48,13.72 0 top
R88  100nF  [R0603]  14.48,14.99 0 top
R89  100nF  [R0603]  14.48,16.26 0 top
R90  100nF  [R0603]  14.48,17.53 0 top
R91  100nF  [R0603]  14.48,18.8 0 top
R92  1k  [R0402]  23.94,11.81 0 top
R93  0R  [R0402]  6.7,14.37 0 bottom
R94  DNP  [R0402]  26.67,14.61 180 bottom
R95  DNP  [R0402]  26.67,11.94 180 bottom
R96  10k  [R0402]  26.67,9.27 180 bottom
R97  DNP  [R0402]  6.73,3.56 0 bottom
R98  150R_1%  [R0402]  9.91,8 270 top
R99  150R_1%  [R0402]  12.06,8 270 top
R100  150R_1%  [R0402]  14.1,8 0 top
R101  4.7k  [R0402]  4.7,27.05 270 bottom
R102  4.7k  [R0402]  4.7,30.99 90 bottom
R103  4.7k  [R0402]  4.7,29.08 270 bottom
R104  DNP  [R0402]  51.82,26.8 0 bottom
R105  DNP  [R0402]  5.21,4.95 270 bottom
R106  DNP  [R0402]  3.68,3.56 180 bottom
R107  33R  [R0402]  23.37,18.67 270 bottom
R108  33R  [R0402]  26.67,13.72 0 bottom
R109  33R  [R0402]  26.67,11.05 0 bottom
R110  33R  [R0402]  26.67,8.38 180 bottom
R111  33R  [R0402]  54.36,26.16 0 top
R112  33R  [R0402]  6.22,4.95 270 bottom
R113  33R  [R0402]  3.3,4.95 270 bottom
R114  10k  [R0402]  47.5,23.62 270 top
R115  33R  [R0402]  48.01,17.65 0 top
R116  DNP  [R0402]  51.82,25.91 0 bottom
R117  10k  [R0402]  51.05,29.21 0 top
R118  20k  [R0402]  47.62,9.14 90 bottom
R119  10k  [R0402]  48.51,7.37 270 bottom
R120  20k  [R0402]  48.51,9.14 90 bottom
R121  10k  [R0402]  49.4,7.37 270 bottom
R122  20k  [R0402]  49.4,9.14 90 bottom
R123  10k  [R0402]  50.29,7.37 270 bottom
R124  20k  [R0402]  50.29,9.14 90 bottom
R125  DNP  [R0402]  58.7,20.32 0 top
R126  10k  [R0402]  58.71,21.26 180 top
R127  DNP  [R0402]  51.82,25.02 0 bottom
R128  100R_1%  [R0402]  39.5,31.75 0 bottom
R129  100R_1%  [R0402]  39.5,30.73 0 bottom
R130  100k  [R0402]  39.5,12.83 270 top
R133  10k  [R0402]  51.18,7.37 270 bottom
R134  536k_1%  [R0603]  11.43,22.48 270 top
R135  100K_1%  [R0603]  12.95,22.48 270 top
R140  33R  [R0402]  48.01,14.99 0 top
R141  33R  [R0402]  48.01,15.88 0 top
R142  33R  [R0402]  48.01,13.21 0 top
R143  33R  [R0402]  48.01,14.1 0 top
R144  4.7k  [R0402]  57.53,26.29 270 bottom
R145  10k  [R0402]  47.5,31.5 180 top
R146  DNP  [R0402]  60.83,30.73 180 bottom
R147  DNP  [R0402]  47.5,30.61 180 top
R148  DNP  [R1206]  43.18,13.08 270 bottom
R149  DNP  [R0402]  20.83,34.16 0 top
R150  DNP  [R0402]  60.83,31.62 180 bottom
R151  4.7k  [R0402]  60.83,32.51 180 bottom
R152  1k  [R0402]  40.39,39.62 90 bottom
R153  2k  [R0402]  40.39,37.72 270 bottom
R154  1k  [R0402]  39.5,39.62 90 bottom
R155  2k  [R0402]  39.5,37.72 270 bottom
R156  1k  [R0402]  38.61,39.62 90 bottom
R157  2k  [R0402]  38.61,37.72 270 bottom
R158  1k  [R0402]  37.72,39.62 90 bottom
R159  2k  [R0402]  37.72,37.72 270 bottom
R160  1k  [R0402]  33.27,39.62 90 bottom
R161  2k  [R0402]  33.27,37.72 270 bottom
R162  1k  [R0402]  32.38,39.62 90 bottom
R163  2k  [R0402]  32.38,37.72 270 bottom
R164  10k  [R0402]  31.5,39.62 90 bottom
R165  20k  [R0402]  31.5,37.72 270 bottom
R166  1k  [R0402]  30.61,39.62 90 bottom
R167  2k  [R0402]  30.61,37.72 270 bottom
R171  4.7k  [R0402]  60.83,33.4 180 bottom
R172  1k  [R0402]  36.83,39.62 90 bottom
R173  2k  [R0402]  36.83,37.72 270 bottom
R174  1k  [R0402]  35.94,39.62 90 bottom
R175  2k  [R0402]  35.94,37.72 270 bottom
R176  1k  [R0402]  35.05,39.62 90 bottom
R177  2k  [R0402]  35.05,37.72 270 bottom
R178  1k  [R0402]  34.16,39.62 90 bottom
R179  2k  [R0402]  34.16,37.72 270 bottom
R180  4.7k  [R0402]  56.64,26.29 270 bottom
R181  DNP  [R0402]  55.75,26.29 270 bottom
R182  DNP  [R0402]  54.86,26.29 270 bottom
R183  10k  [R0402]  60.83,28.96 0 bottom
R184  DNP  [R0402]  60.83,29.84 0 bottom
R185  10k  [R0402]  62.36,35.56 270 top
R186  DNP  [R0402]  58.67,24.77 180 top
R187  DNP  [R0402]  61.34,35.56 270 top
RST  SKRPADE010  [SW4P-SMD-4.5X3.2X2.5MM]  57.91,8 90 top
SW1  311010004  [SW6-2.54-9.0X3.5X3.2+2.0MM]  4.95,50.67 0 top
SW2  DG2788A  [MINI-QFN16-0.4-2.6X1.8X0.55MM]  53.95,7.89 270 bottom
SW4  [10P-SMD-7.95X5.4X2.3MM]  31.88,9.4 0 top
TP1  [TP_3535]  50.16,24.77 0 bottom
TP2  [TP_3535]  50.16,26.67 0 bottom
TP5  [TP-D45MIL]  17.78,23.75 90 bottom
U1  XC7S15-1FTGB196C  [FTGB196-1.0-15X15X1.46MM]  35.56,27.3 0 top
U2  ESP32-D0WDQ6  [QFN48G-0.4-6X6MM]  53.34,20.19 90 top
U3  W25Q32JVZPIG  [SOIC8-1.27-5X4MM]  46.35,22.23 180 bottom
U4  ADC1173  [TSSOP24-0.65-7.8X4.4MM]  47.88,31.88 0 bottom
U5  CP2102-GMR  [QFN28]  20.45,38.48 0 top
U6  DAC7311IDCKR  [SC-70-6]  54.23,30.61 180 top
U7  CJ1117-3V3  [SOT-223]  12.06,38.73 180 bottom
U8  XC6221B102MR  [SOT-23-5]  20.32,43.31 180 bottom
U9  RT9013-18GB  [SOT-23-5]  34.29,6.86 270 bottom
U10  Arduino pins  [ARDUINO-32P]  0,0 0 top
U11  TPS62130  [VQFN16-0.5-3X3X1MM]  14.86,26.92 270 top
U12  LSM6DS3TR  [LGA14L_DOT_INDICATOR]  47.48,26.85 270 top
U13  PCA9306DQER  [X2SON8-0.35-1.4X1X0.37MM]  11.68,20.32 270 bottom
U15  RCLAMP0524P  [ESD10P-0.5-2.5X1X0.58MM]  10.03,10.67 90 top
U16  RCLAMP0524P  [ESD10P-0.5-2.5X1X0.58MM]  10.03,13.78 90 top
U17  TXS0104EPWR  [TSSOP14-0.65-5X4.4MM]  56.52,31.62 0 bottom
U18  TXS0104EPWR  [TSSOP14-0.65-5X4.4MM]  58.55,29.84 0 top
U$64  [SEEED-SILK-TNAME-280*268MIL]  39.24,37.21 0 top
U$65  [OSHW_FILLX200_NOTEXT_TNAME]  29.27,35.81 0 top
USB2  320010516/ ST-USB-1410  [USB2.0-TYPE-C]  6.35,38.1 0 top
X2  O3225100MEDA4SC  [X4-SMD-3.2X2.5X1MM]  21.84,32 180 top
X3  XTL581100-M118-080  [X4-SMD-2.5X2.0X1.0MM]  53.21,12.7 180 top

## Tracks (layer width: path | path; a pad name or v marks a point on that pad's centre or on a via)
3V3_IMU
  Top 0.254: U12.8 48.66,25.93 48.64,25.91 | U12.5 46.98,25.28 47.12,25.15 48.39,25.15 | 48.39,25.15 48.64,25.15 | 48.39,25.15 48.64,25.4 | 48.39,25.15 48.64,24.89 | R117.2 51.52,29.19 50.65,28.32 FB5.2
  Top 0.305: R114.2 47.5,23.19 C99.1
  Top 0.406: C99.1 48.39,24.13 | 48.39,24.13 48.64,24.38 48.64,24.51 | 48.64,24.51 48.64,24.89 48.64,25.15 48.64,25.4 48.64,25.91 | 49.02,24.13 49.53,24.13 50.59,25.19 C84.1 50.29,26.08 C97.2 50.29,28.02 FB5.2 | 49.02,24.13 48.39,24.13 | 48.64,24.51 49.02,24.13
ADC_CLK  (via drill 0.2 pad 0.41)
  Top 0.102: U1.C5 33.06,31.84 v32.64,32.26
  Route14 0.102: v44.32,33.02 44.2,32.89 33.27,32.89 v32.64,32.26
  Bottom 0.102: U4.12 44.3,33 v44.32,33.02
ADC_D0  (via drill 0.2 pad 0.41)
  Top 0.102: U1.J3 31.01,25.8 v30.61,25.4
  Route14 0.102: v30.61,25.4 30.99,25.78 32,25.78 32.26,26.04 40.89,26.04 41.91,25.02 46.74,25.02 49.4,27.69 v49.4,27.81
  Bottom 0.102: U4.3 50.15,27.93 50.04,27.81 v49.4,27.81
ADC_D1  (via drill 0.2 pad 0.41)
  Top 0.102: U1.J2 30,25.8 v29.59,25.4
  Route14 0.102: v29.59,25.4 30.23,26.04 31.88,26.04 32,26.16 32,26.54 32.26,26.8 41.53,26.8 41.78,27.05 44.32,27.05 45.47,28.19 48.01,28.19 v49.53,29.72
  Bottom 0.102: U4.4 49.5,29.69 v49.53,29.72
ADC_D2  (via drill 0.2 pad 0.41)
  Top 0.102: U1.D12 40.46,30.8 40.96,31.3 v41.4,31.3
  Route14 0.102: v49.15,31.75 48.9,31.5 41.59,31.5 v41.4,31.3
  Bottom 0.102: U4.5 48.85,29.68 49.53,30.35 49.53,31.37 v49.15,31.75
ADC_D3  (via drill 0.2 pad 0.41)
  Top 0.102: U1.E12 40.09,29.8 40.64,30.35 v41.53,30.35
  Route14 0.102: v49.15,30.86 45.97,30.86 44.96,29.84 42.04,29.84 v41.53,30.35
  Bottom 0.102: U4.6 48.2,29.79 48.51,30.1 48.9,30.1 49.15,30.35 v49.15,30.86
ADC_D4  (via drill 0.2 pad 0.41)
  Top 0.102: U1.F12 40.11,28.8 v40.51,29.21
  Route14 0.102: v40.51,29.21 43.18,29.21 43.31,29.21 44.7,29.21 45.97,30.48 v48.64,30.48
  Bottom 0.102: U4.7 47.55,30.16 47.88,30.48 v48.64,30.48
ADC_D5  (via drill 0.2 pad 0.41)
  Top 0.102: U1.C11 39.06,31.82 v39.5,32.26
  Route14 0.102: v39.5,32.26 39.88,32.64 v44.96,32.64
  Bottom 0.102: U4.8 46.9,30.06 44.96,32 v44.96,32.64
ADC_D6  (via drill 0.2 pad 0.41)
  Top 0.102: U1.H11 39.12,26.8 39.12,26.79 v39.5,26.42
  Bottom 0.102: v39.5,26.42 40.13,25.78 42.93,25.78 44.32,27.18 45.09,27.18 45.21,27.18 46.1,27.18 46.35,27.43 46.35,27.94 46.25,28.04 U4.9
ADC_D7  (via drill 0.2 pad 0.41)
  Top 0.102: U1.H12 40.12,26.8 v40.51,26.42
  Bottom 0.102: U4.10 45.6,28.08 45.34,27.81 44.58,27.81 42.8,26.04 40.89,26.04 v40.51,26.42
ADC_EN  (via drill 0.2 pad 0.41)
  Top 0.102: U1.J4 32.03,25.8 v31.62,25.4
  Route14 0.102: v31.62,25.4 32,25.4 32.38,25.78 40.77,25.78 41.78,24.77 46.86,24.77 51.05,28.96 52.83,28.96 v53.09,28.7
  Bottom 0.102: U4.1 52.88,28.9 v53.09,28.7
ADC_IN  (via drill 0.2 pad 0.41)
  Top 0.406: J1.1 31.11,44.7 v30.48,45.34
  Route14 0.406: v44.32,45.09 43.31,46.1 31.24,46.1 v30.48,45.34
  Bottom 0.406: U4.19 48.2,35.87 45.97,38.1 45.97,43.43 v44.32,45.09 | v30.48,45.34 C87.1
AGND
  Top 0.203: U11.6 14.61,24.96
  Top 0.305: 14.35,24.51 14.61,24.77 14.61,24.96 14.29,24.64
  pour Top (isolate 0.254, no thermals): 17.65,21.84 17.65,21.06 16.91,20.32 12.95,20.32 12.57,20.7 12.57,21.72 12.83,21.97 13.19,21.97 13.72,22.49 13.72,24.51 14.1,24.89 14.43,24.89 14.61,24.71 14.61,22.9 15.41,22.1 17.4,22.1
AR_3V3_EN  (via drill 0.2 pad 0.41)
  Top 0.102: U1.L13 41.09,23.8 v41.53,23.37
  Bottom 0.102: v41.53,23.37 41.15,22.99 41.15,21.08 41.4,20.83 Q2.1 | R48.1 42.37,17.48 41.53,16.64 Q2.1 | Q3.1 41.27,13.08 40.39,13.97 40.39,15.75 41.27,16.64 Q2.1
AR_A0
  Bottom 0.102: U10.19 49.91,2.54 45.85,6.6 R32.2
AR_A1
  Bottom 0.102: R34.2 46.74,6.22 49.28,3.68 52.58,3.68 53.34,2.92 U10.20
AR_A2
  Bottom 0.102: U10.21 55.88,2.79 54.74,3.94 49.4,3.94 47.62,5.71 R36.2
AR_A3
  Bottom 0.102: R119.2 48.51,5.33 49.66,4.19 56.77,4.19 U10.22
AR_A4
  Bottom 0.102: U10.23 59.05,4.45 50.04,4.45 49.4,5.08 R121.2
AR_A5
  Bottom 0.102: R123.2 50.29,5.71 51.31,4.7 60.58,4.7 62.74,2.54 U10.24
AR_D0/RX
  Bottom 0.102: U10.1 63.5,49.02 59.05,44.58 59.05,37.08 57.91,35.94 57.02,35.94 56.52,35.43 U17.11 56.52,33.78 57.4,32.89 59.1,32.89 R150.1
AR_D1/TX
  Bottom 0.102: R146.1 59.94,30.73 59.82,30.86 59.82,31.75 58.93,32.64 57.02,32.64 55.87,33.8 U17.10 55.87,37.07 56.64,37.85 58.17,37.85 58.8,38.48 58.8,44.83 60.96,46.99 U10.2
AR_D2
  Bottom 0.102: R152.2 40.39,41.66 40.89,42.16 42.67,42.16 43.69,43.18 43.69,45.34 44.07,45.72 50.8,45.72 52.07,46.99 52.07,48.77 52.45,49.15 56.77,49.15 U10.3
AR_D3
  Bottom 0.102: R154.2 39.5,41.91 40.01,42.42 42.55,42.42 43.43,43.31 43.43,45.59 43.81,45.97 48.77,45.97 49.66,46.86 49.66,48.77 50.29,49.4 54.48,49.4 U10.4
AR_D4
  Bottom 0.102: R156.2 38.61,42.16 39.12,42.67 42.42,42.67 43.18,43.43 43.18,45.85 43.56,46.23 48.51,46.23 49.4,47.12 49.4,48.9 50.16,49.66 52.2,49.66 U10.5
AR_D5
  Bottom 0.102: R158.2 37.72,42.16 38.48,42.93 40.13,42.93 40.51,43.31 40.51,45.97 41.02,46.48 46.74,46.48 47.12,46.86 47.12,49.15 47.62,49.66 49.66,49.66 U10.6
AR_D6
  Bottom 0.102: R172.2 36.83,41.78 38.23,43.18 40.01,43.18 40.26,43.43 40.26,46.23 40.77,46.74 46.61,46.74 46.86,46.99 46.86,49.4 U10.7
AR_D7
  Bottom 0.102: R174.2 35.94,42.29 36.45,42.8 37.47,42.8 38.1,43.43 38.1,48.77 38.61,49.28 44.2,49.28 U10.8
AR_D8
  Bottom 0.102: R176.2 35.05,42.16 35.94,43.05 37.34,43.05 37.85,43.56 37.85,48.9 38.48,49.53 40.39,49.53 U10.9
AR_D9
  Bottom 0.102: R178.2 34.16,41.78 35.43,43.05 35.43,49.02 36.2,49.78 38.1,49.78 U10.10
AR_D10
  Bottom 0.102: R160.2 33.27,41.27 35.18,43.18 35.18,49.4 U10.11
AR_D11
  Bottom 0.102: R162.2 32.38,40.64 32.89,41.15 32.89,49.66 U10.12
AR_D12
  Bottom 0.102: R164.2 31.5,40.64 32.64,41.78 32.64,49.66 U10.13
AR_D13
  Bottom 0.102: U10.14 30.35,49.4 30.35,47.12 31.37,46.1 31.37,41.4 30.61,40.64 R166.2
AR_MISO
  Top 0.102: J5.1 61.34,30.48 60.33,31.5 58.93,31.5 58.55,31.88 U18.11
AR_MOSI
  Top 0.102: U18.12 57.9,32 58.66,31.24 60.07,31.24 62.1,29.21 64.77,29.21 J5.5
AR_RESET  (via drill 0.2 pad 0.41)
  Top 0.102: U18.10 59.2,34.3 59.99,35.1 R187.2 v61.34,34.54
  Route3 0.102: 61.21,25.53 61.21,34.42 v61.34,34.54 | 61.21,25.53 61.21,25.4 | 61.21,25.4 61.34,25.4 | 61.34,25.4 J5.3 | U10.30 34.92,4.45 55.24,4.45 59.69,8.89 59.69,15.49 59.44,15.75 56.52,15.75 54.99,17.27 54.99,21.84 55.24,22.1 56.39,22.1 57.15,22.86 57.15,24.13 58.42,25.4 61.21,25.4 | 61.34,25.4 61.21,25.53
AR_SCK
  Top 0.102: J5.2 62.99,27.94 59.94,30.99 58.29,30.99 57.34,31.94 57.28,32 57.25,32.03 U18.13
AR_SCL  (via drill 0.2 pad 0.41)
  Top 0.102: U10.18 20.32,49.28 59.56,49.28 v59.94,48.9
  Route3 0.102: v59.94,48.9 59.94,36.96 59.56,36.58 v59.05,36.58
  Bottom 0.102: R151.1 59.94,32.51 59.31,33.15 57.78,33.15 57.16,33.77 U17.12 57.16,35.45 57.4,35.69 58.17,35.69 v59.05,36.58
AR_SDA  (via drill 0.2 pad 0.41)
  Top 0.102: U10.17 22.61,49.53 59.94,49.53 60.33,49.15 v60.33,48.39
  Route3 0.102: v60.33,48.39 60.33,36.83 v59.56,36.07
  Bottom 0.102: R171.1 58.17,33.4 57.81,33.75 U17.13 57.81,35.34 57.91,35.43 58.29,35.43 58.93,36.07 v59.56,36.07
CHIP_PU  (via drill 0.2 pad 0.41)
  Top 0.102: U2.9 57.01,21.19 v57.02,21.21 | v56.01,13.08 56.01,11.56 56.64,10.92 58.67,10.92 58.85,10.74 RST.2 RST.1
  Route14 0.102: v57.02,21.21 56.52,20.7 56.52,13.59 v56.01,13.08
  Bottom 0.102: R5.1 55.75,14.27 55.75,13.72 55.24,13.21 Q4.3 v56.01,13.08
D+
  Top 0.152: USB2.A6 5.33,38.35 5.08,38.1 5.08,37.59 5.32,37.35 USB2.B6 | L15.3 14.14,38.65
  Top 0.218: USB2.A6 8.3,38.35 D1.2 9.44,38.48 13.84,38.48 14.01,38.65 14.14,38.65
D-  (via drill 0.2 pad 0.41)
  Top 0.152: USB2.A7 v5.59,37.85 | USB2.B7 v5.6,38.85 v5.59,38.86 | L15.2 14.14,37.8
  Top 0.218: USB2.A7 8.68,37.85 D2.2 8.94,37.64 9.4,38.1 13.72,38.1 14.01,37.8 14.14,37.8
  Bottom 0.152: v5.59,37.85 v5.59,38.86
DAC_DIN  (via drill 0.2 pad 0.41)
  Top 0.102: U1.L1 28.39,23.8 28.07,24.13 28.07,26.29 26.8,27.56 v26.8,36.32 | U6.3 53.58,31.77 52.58,32.77 52.58,36.2 52.7,36.32 v53.47,36.32
  Route14 0.102: v53.47,36.32 52.7,36.32 51.82,35.43 43.81,35.43 43.18,36.07 27.05,36.07 v26.8,36.32
DAC_OUT  (via drill 0.2 pad 0.41)
  Top 0.305: U6.6 54.88,30.21 v54.86,30.23
  Top 0.406: J1.4 41.66,43.18 v44.58,40.26
  Route3 0.406: v54.86,30.23 51.94,30.23 44.58,37.59 v44.58,40.26
  Bottom 0.406: C86.1 44.53,40.21 v44.58,40.26
DAC_SCLK  (via drill 0.2 pad 0.41)
  Top 0.102: U1.M1 28.63,22.8 27.81,23.62 27.81,26.16 26.42,27.56 v26.42,35.81 | U6.2 54.23,32.26 54.1,32.38 53.34,32.38 52.96,32.77 v52.96,35.94
  Route14 0.102: v52.96,35.94 52.2,35.18 43.69,35.18 43.05,35.81 v26.42,35.81
DAC_SYNC  (via drill 0.2 pad 0.41)
  Top 0.102: U1.N1 28.49,21.8 27.56,22.73 27.56,26.04 26.04,27.56 v26.04,35.31 | U6.1 54.88,32.24 54.48,32.64 53.47,32.64 53.21,32.89 53.21,35.05 v53.47,35.31
  Route14 0.102: v26.04,35.31 26.54,35.31 26.8,35.56 42.93,35.56 43.56,34.92 53.09,34.92 v53.47,35.31
ESP_A4  (via drill 0.2 pad 0.41)
  Route14 0.102: v53.72,7.49 53.47,7.75 49.91,7.75 v49.4,8.26
  Bottom 0.102: R121.1 v49.4,8.26 R122.1 | SW2.11 53.74,7.47 v53.72,7.49
ESP_A5
  Bottom 0.102: SW2.15 52.24,8.09 51.64,8.68 R124.1 R123.1
ESP_AR_A0  (via drill 0.2 pad 0.41)
  Top 0.102: U2.5 56.99,19.59 v57.02,19.56
  Route14 0.102: v57.02,19.56 57.15,19.56 57.66,19.05 57.66,11.18 55.88,9.4 46.99,9.4 v45.85,8.26
  Bottom 0.102: R32.1 v45.85,8.26 R33.1
ESP_AR_A1  (via drill 0.2 pad 0.41)
  Top 0.102: U2.6 57.35,19.99 v57.4,19.94
  Route14 0.102: v57.4,19.94 57.91,19.43 57.91,11.05 56.01,9.14 47.62,9.14 v46.74,8.26
  Bottom 0.102: R34.1 v46.74,8.26 R35.1
ESP_AR_A2  (via drill 0.2 pad 0.41)
  Top 0.102: U2.7 56.99,20.39 v57.02,20.42
  Route14 0.102: v57.02,20.42 57.56,20.42 58.17,19.81 58.17,10.92 56.13,8.89 48.26,8.89 v47.62,8.26
  Bottom 0.102: R118.1 v47.62,8.26 R36.1
ESP_AR_A3  (via drill 0.2 pad 0.41)
  Top 0.102: U2.8 57.37,20.79 v57.4,20.83
  Route14 0.102: v57.4,20.83 57.66,20.83 58.42,20.07 58.42,10.79 56.26,8.64 48.9,8.64 v48.51,8.26
  Bottom 0.102: R119.1 v48.51,8.26 R120.1
ESP_FPGA-TYPE
  Top 0.102: U2.11 57.51,21.99 R126.2 | R126.2 | R125.1 58.24,21.25 R126.2
ESP_QSPI_CLK
  Top 0.102: U2.35 49.76,18.39 49.66,18.29 49.66,17.53 48.9,16.76 R84.2
ESP_QSPI_CS
  Top 0.102: U2.34 49.53,18.79 49.4,18.67 49.4,18.16 48.9,17.65 R115.2
ESP_QSPI_D
  Top 0.102: U2.36 50.12,17.99 49.91,17.78 49.91,16.89 48.9,15.88 R141.2
ESP_QSPI_HD  (via drill 0.2 pad 0.41)
  Top 0.102: U2.42 53.14,16.67 v53.11,16.64 | R142.2 v48.9,13.21
  Route3 0.102: v48.9,13.21 48.9,13.34 51.05,15.49 52.83,15.49 53.09,15.75 53.09,16.61 v53.11,16.64
ESP_QSPI_Q  (via drill 0.2 pad 0.41)
  Top 0.102: R140.2 v48.9,14.99 | U2.38 51.54,16.55 v51.5,16.51
  Route3 0.102: v51.5,16.51 50.29,16.51 48.9,15.11 v48.9,14.99
ESP_QSPI_WP  (via drill 0.2 pad 0.41)
  Top 0.102: U2.39 51.94,16.19 v51.88,16.13 | R143.2 v48.9,14.1
  Route3 0.102: v51.88,16.13 51.18,16.13 49.15,14.1 v48.9,14.1
ESP_SCL_A5  (via drill 0.2 pad 0.41)
  Top 0.102: U2.13 55.7,23.19 v55.88,23.37
  Route3 0.102: v51.56,9.78 51.56,13.34 53.98,15.75 53.98,16.76 52.58,18.16 52.58,22.1 53.59,23.11 55.63,23.11 v55.88,23.37
  Bottom 0.102: SW2.16 52.47,8.49 51.56,9.4 v51.56,9.78
ESP_SDA_A4  (via drill 0.2 pad 0.41)
  Top 0.102: U2.12 57.32,22.39 v57.4,22.48
  Route14 0.102: v53.21,6.35 54.36,6.35 58.67,10.67 58.67,21.21 v57.4,22.48
  Bottom 0.102: SW2.12 53.34,6.48 v53.21,6.35
FLASH_SCK  (via drill 0.2 pad 0.41)
  Top 0.102: R29.2 49.02,20.32 49.33,20.02 v49.58,20.02 49.6,19.99 U2.31
  Bottom 0.102: U3.6 46.99,20.32 47.5,20.83 48.77,20.83 v49.58,20.02
FLASH_SCS  (via drill 0.2 pad 0.41)
  Top 0.102: U2.30 49.33,20.39 48.51,21.21 R28.2 48.47,21.16 48.07,20.77 46.8,20.77 v45.97,21.59
  Bottom 0.102: v45.97,21.59 44.45,23.11 U3.1 44.45,25.78 44.83,26.16 47.75,26.16 49.02,27.43 51.18,27.43 51.35,27.26 R104.2
FLASH_SDI  (via drill 0.2 pad 0.41)
  Top 0.102: 48.64,18.54 R69.2 v48.9,18.54 48.9,18.92 49.16,19.19 U2.33
  Bottom 0.102: U3.5 48.26,18.75 R69.2 v48.9,18.54
FLASH_SDO  (via drill 0.2 pad 0.41)
  Top 0.102: U2.32 49.06,19.59 v49.02,19.56 48.9,19.43 R68.2
  Route3 0.102: v49.02,19.56 49.02,20.57 48.64,20.95 48.64,22.86 48.26,23.24 46.35,23.24 46.23,23.37 46.23,23.75 v46.16,23.81
  Bottom 0.102: U3.2 45.72,24.26 v46.16,23.81
FLASH_SHD  (via drill 0.2 pad 0.41)
  Top 0.102: U2.28 49.8,21.19 v49.78,21.21
  Bottom 0.102: v49.78,21.21 49.02,21.21 | 49.02,21.21 46.48,21.21 45.72,20.45 U3.7 | R127.2 50.42,25.02 TP1.T 49.02,23.62 49.02,21.21
FLASH_SWP  (via drill 0.2 pad 0.41)
  Top 0.102: U2.29 49.44,20.79 v49.4,20.83
  Route3 0.102: v46.74,23.62 48.26,23.62 48.9,22.99 48.9,21.34 v49.4,20.83
  Bottom 0.102: v46.74,23.62 46.99,23.88 U3.3 46.99,25.65 47.24,25.91 48.01,25.91 48.77,26.67 TP2.T 50.93,25.91 R116.2
FLASH_VDD  (via drill 0.2 pad 0.41)
  Top 0.254: U2.26 49.63,21.99 v49.53,22.1
  Bottom 0.406: R2.2 48.56,16.55 50.42,18.41 50.42,21.59 49.91,22.1 v49.53,22.1
FPGA_AR_D0/RX  (via drill 0.2 pad 0.41)
  Top 0.102: U1.A12 40.06,33.84 v40.51,34.29
  Route14 0.102: v40.51,34.29 41.27,33.53 43.88,33.53 44.01,33.66 45.97,33.66 46.35,33.27 55.5,33.27 v56.9,31.88
  Bottom 0.102: R181.1 55.75,27.18 56.52,27.94 U17.4 56.52,29.59 56.77,29.84 56.77,31.75 v56.9,31.88
FPGA_AR_D1/TX  (via drill 0.2 pad 0.41)
  Top 0.102: U1.C12 v40.51,32.26
  Route14 0.102: v40.51,32.26 41.02,31.75 48.51,31.75 48.9,32.13 53.34,32.13 v54.61,30.86
  Bottom 0.102: R182.1 54.86,26.8 55.87,27.8 U17.5 55.87,29.99 54.99,30.86 v54.61,30.86
FPGA_AR_D2  (via drill 0.2 pad 0.41)
  Top 0.102: U1.A10 38.06,35.27 39.88,37.08 39.88,38.1 v40.39,38.61
  Route14 0.102: v40.39,38.61 47.37,38.61 48.64,39.88 54.31,39.88 J2.1
  Bottom 0.102: R152.1 v40.39,38.61 R153.1
FPGA_AR_D3  (via drill 0.2 pad 0.41)
  Top 0.102: U1.B6 33.87,32.8 33.53,33.15 33.53,34.67 33.78,34.92 37.34,34.92 39.62,37.21 39.62,38.48 v39.5,38.61
  Route14 0.102: v39.5,38.61 40.26,37.85 54.27,37.85 J2.2
  Bottom 0.102: R155.1 v39.5,38.61 R154.1
FPGA_AR_D4  (via drill 0.2 pad 0.41)
  Top 0.102: U1.A5 33.06,34.84 33.4,35.18 33.91,35.18 34.04,35.18 37.21,35.18 38.1,36.07 38.1,38.35 38.35,38.61 v38.61,38.61
  Bottom 0.102: R157.1 v38.61,38.61 R156.1
FPGA_AR_D5  (via drill 0.2 pad 0.41)
  Top 0.102: v37.72,38.61 37.72,36.07 37.08,35.43 32.89,35.43 32.64,35.18 32.64,34.29 32.64,34.16 32.64,33.15 32.98,32.8 U1.B5
  Bottom 0.102: R158.1 v37.72,38.61 R159.1
FPGA_AR_D6  (via drill 0.2 pad 0.41)
  Top 0.102: v36.83,38.61 36.32,38.1 36.32,36.45 35.56,35.69 32.64,35.69 32.06,35.11 U1.A4
  Bottom 0.102: R173.1 v36.83,38.61 R172.1
FPGA_AR_D7  (via drill 0.2 pad 0.41)
  Top 0.102: v35.94,38.61 35.94,36.58 35.31,35.94 33.66,35.94 33.53,35.94 31.62,35.94 31.06,35.38 U1.A3
  Bottom 0.102: R175.1 v35.94,38.61 R174.1
FPGA_AR_D8  (via drill 0.2 pad 0.41)
  Top 0.102: U1.B3 31.06,32.82 30.61,33.27 30.61,36.32 31.62,37.34 33.78,37.34 v35.05,38.61
  Bottom 0.102: R177.1 v35.05,38.61 R176.1
FPGA_AR_D9  (via drill 0.2 pad 0.41)
  Top 0.102: U1.A2 30.06,36.16 31.5,37.59 33.15,37.59 v34.16,38.61
  Bottom 0.102: R179.1 v34.16,38.61 R178.1
FPGA_AR_D10  (via drill 0.2 pad 0.41)
  Top 0.102: U1.B2 29.59,33.27 29.59,36.07 31.37,37.85 32.51,37.85 v33.27,38.61
  Bottom 0.102: R161.1 v33.27,38.61 R160.1
FPGA_AR_D11  (via drill 0.2 pad 0.41)
  Top 0.102: U1.B1 29.04,32.8 28.19,33.66 28.19,35.05 31.24,38.1 31.88,38.1 v32.38,38.61
  Bottom 0.102: R163.1 v32.38,38.61 R162.1
FPGA_AR_D12  (via drill 0.2 pad 0.41)
  Top 0.102: U1.H1 28.82,26.8 27.69,27.94 27.69,34.92 31.37,38.61 v31.5,38.61
  Bottom 0.102: R165.1 v31.5,38.61 R164.1
FPGA_AR_D13  (via drill 0.2 pad 0.41)
  Top 0.102: U1.H2 30.06,26.76 29.59,26.29 28.83,26.29 27.43,27.69 27.43,35.05 29.59,37.21 v29.59,38.23
  Bottom 0.102: R166.1 R167.1 29.64,38.18 v29.59,38.23
FPGA_AR_DET  (via drill 0.2 pad 0.41)
  Top 0.102: U1.B11 39.06,32.84 v39.5,33.27
  Route3 0.102: v39.5,33.27 40.01,32.77 41.53,32.77 41.91,32.38 41.91,20.95 42.29,20.57 42.29,19.05 43.18,18.16 43.18,16.26 v43.05,16.13
  Bottom 0.102: R71.2 R49.2 44.96,12.32 44.58,12.7 44.58,14.86 43.31,16.13 v43.05,16.13
FPGA_AR_MISO  (via drill 0.2 pad 0.41)
  Top 0.102: U1.L5 v32.64,23.37 | U18.4 v58.55,29.97
  Route14 0.102: v32.64,23.37 33.02,23.75 44.83,23.75 45.34,24.26 47.12,24.26 50.67,27.81 53.47,27.81 54.36,28.7 59.18,28.7 59.56,29.08 59.56,29.72 59.31,29.97 v58.55,29.97
FPGA_AR_MOSI  (via drill 0.2 pad 0.41)
  Top 0.102: U1.M5 33.06,22.77 v32.64,22.35 | U18.3 57.9,29.83 58.42,30.35 v59.18,30.35
  Route14 0.102: v32.64,22.35 33.02,21.97 43.56,21.97 44.32,22.73 46.86,22.73 51.69,27.56 53.59,27.56 54.48,28.45 59.31,28.45 59.82,28.96 59.82,29.97 59.44,30.35 v59.18,30.35
FPGA_AR_OE1  (via drill 0.2 pad 0.41)
  Top 0.102: U1.N4 32.06,21.77 v31.62,21.34
  Route14 0.102: v31.62,21.34 32,21.72 43.69,21.72 44.45,22.48 46.99,22.48 51.69,27.18 v53.29,27.18
  Bottom 0.102: R183.2 R184.2 59.94,29.84 59.56,30.23 59.56,31.62 58.8,32.38 54.61,32.38 | 54.61,32.38 54.52,32.38 | 54.52,32.48 54.52,32.38 | 54.52,32.38 54.52,32.29 | 54.52,32.29 54.52,32.04 53.59,31.11 53.59,27.48 v53.29,27.18 | 54.52,32.48 54.61,32.38 | 54.52,32.29 54.61,32.38 | 54.52,32.48 54.52,34.5 U17.8
FPGA_AR_OE2  (via drill 0.2 pad 0.41)
  Top 0.102: U1.M3 v30.61,22.35 | R185.2 v62.36,34.54 61.85,34.04 60.96,34.04 60.58,33.66 60.55,33.62 60.5,33.57 U18.8
  Route3 0.102: v30.61,22.35 31.11,22.86 31.11,25.65 31.37,25.91 32,25.91 32.26,26.16 32.26,33.02 33.66,34.42 v34.04,34.42
  Route14 0.102: v34.04,34.42 34.67,33.78 38.1,33.78 39.12,34.8 42.29,34.8 43.31,33.78 43.81,33.78 44.45,34.42 56.64,34.42 57.15,34.92 61.98,34.92 v62.36,34.54
FPGA_AR_RESET  (via drill 0.2 pad 0.41)
  Top 0.102: U1.K4 32.04,24.8 v31.62,24.38 | R186.1 59.2,24.83 U18.5 59.2,29.45 v59.18,29.46
  Route14 0.102: v31.62,24.38 32,24 44.7,24 45.21,24.51 46.99,24.51 51.18,28.7 52.45,28.7 52.83,28.32 53.47,28.32 54.1,28.96 56.26,28.96 56.77,29.46 v59.18,29.46
FPGA_AR_SCK  (via drill 0.2 pad 0.41)
  Top 0.102: U1.H13 41.14,26.8 v41.53,26.42 | U18.2 57.25,27.81 56.39,28.67 v56.39,30.48
  Route14 0.102: v41.53,26.42 41.91,26.8 44.45,26.8 45.59,27.94 48.13,27.94 49.02,28.83 49.78,28.83 50.67,29.72 55.63,29.72 v56.39,30.48
FPGA_CAM_CN  (via drill 0.2 pad 0.41)
  Top 0.193: U1.F11 39.09,28.8 v39.5,29.21 | R100.1 13.63,7.96 13.84,7.75 v13.84,7.24 13.97,7.11 13.97,6.73 13.72,6.48 12.19,6.48 11.87,6.16 11.87,5.4 11.56,5.08 J6.23 J6.8
  Route3 0.102: 41.27,20.83 41.27,20.95 41.15,21.08 41.15,28.45 40.77,28.83 39.88,28.83 v39.5,29.21
  Route3 0.193: 41.27,20.83 41.27,17.27 30.61,6.6 17.65,6.6 17.14,6.1 14.61,6.1 13.97,6.73 13.97,7.11 v13.84,7.24
FPGA_CAM_CP  (via drill 0.2 pad 0.41)
  Top 0.193: U1.G11 39.11,27.8 v39.5,28.19 | R100.2 14.56,7.96 14.35,7.75 14.35,7.37 v14.48,7.24 14.35,7.11 14.35,6.6 13.91,6.16 12.38,6.16 12.19,5.97 12.19,5.4 12.56,5.03 J6.24 J6.9
  Route3 0.102: 40.89,20.83 40.89,28.32 40.64,28.57 39.88,28.57 v39.5,28.19
  Route3 0.193: 40.89,20.83 40.89,20.07 40.77,19.94 40.51,19.94 40.39,19.81 40.39,19.43 40.51,19.3 40.77,19.3 40.89,19.18 40.89,18.8 40.77,18.67 40.45,18.67 40.32,18.54 40.32,18.16 40.45,18.03 40.77,18.03 40.89,17.91 40.89,17.4 30.48,6.99 17.4,6.99 16.89,6.48 14.73,6.48 14.35,6.86 14.35,7.11 v14.48,7.24
FPGA_CAM_DN1  (via drill 0.2 pad 0.41)
  Top 0.193: U1.P11 39.06,20.76 v39.5,20.32 | J6.5 J6.20 8.56,5.13 8.89,5.46 8.89,5.97 9.27,6.35 10.29,6.35 10.67,6.73 10.67,7.75 11.18,8.26 v11.56,8.26 11.81,8.26 12.02,8.46 R99.1
  Route3 0.193: v39.5,20.32 39.37,20.32 39.12,20.07 39.12,17.4 29.46,7.75 13.46,7.75 13.21,7.49 13.21,4 12.57,3.37 10.92,3.37 10.54,3.75 10.54,7.62 11.05,8.13 11.43,8.13 v11.56,8.26
FPGA_CAM_DNO  (via drill 0.2 pad 0.41)
  Top 0.193: U1.J12 40.11,25.8 v40.51,25.4 | J6.2 J6.17 5.56,4.99 5.97,5.4 5.97,6.1 6.6,6.73 8,6.73 8.38,7.11 8.38,7.81 8.76,8.19 9.27,8.19 v9.4,8.32 9.72,8.32 9.86,8.46 R98.1
  Route3 0.102: 37.72,20.57 37.85,20.7 39.75,20.7 40.13,21.08 40.13,25.15 40.39,25.4 v40.51,25.4 40.13,25.78 40.13,27.05 39.12,28.07 39.12,29.34 39.37,29.59 39.88,29.59 40.26,29.97 40.26,31.11 v40.51,31.37
  Route3 0.193: 37.72,20.57 37.47,20.32 37.47,17.91 28.45,8.89 11.56,8.89 11.05,9.4 9.14,9.4 8.64,8.89 8.64,8.45 8.89,8.19 9.27,8.19 v9.4,8.32
  Bottom 0.102: R128.1 40.13,31.75 v40.51,31.37
FPGA_CAM_DP1  (via drill 0.2 pad 0.41)
  Top 0.193: U1.P10 38.06,20.74 v38.48,20.32 | J6.6 J6.21 9.56,5.05 9.27,5.33 9.27,5.84 9.4,5.97 10.41,5.97 10.67,6.22 11.18,6.22 11.3,6.35 11.3,6.86 11.05,7.11 11.05,7.62 11.18,7.75 11.43,7.75 v11.56,7.62 11.68,7.75 11.81,7.75 11.94,7.62 | 11.94,7.62 12.02,7.54 R99.2 12.06,7.62 11.94,7.62
  Route3 0.193: v38.48,20.32 38.73,20.07 38.73,19.43 38.48,19.18 38.48,18.54 38.73,18.29 38.73,17.53 38.35,17.14 38.1,17.14 37.72,16.76 37.72,16.51 37.21,16 36.96,16 36.58,15.62 36.58,15.37 36.2,14.99 35.94,14.99 35.56,14.61 35.56,14.35 35.18,13.97 34.92,13.97 34.54,13.59 34.54,13.34 34.04,12.83 33.78,12.83 33.27,12.32 33.27,12.06 32.77,11.56 32.51,11.56 32.13,11.18 32.13,10.92 31.62,10.41 31.37,10.41 30.99,10.03 30.99,9.78 30.61,9.4 30.35,9.4 29.97,9.02 29.97,8.76 29.34,8.13 13.21,8.13 12.83,7.75 12.83,7.24 12.57,6.99 12.57,6.48 12.83,6.22 12.83,5.84 12.57,5.59 12.57,5.08 12.83,4.83 12.83,4.13 12.45,3.75 11.18,3.75 10.92,4 10.92,7.49 11.18,7.75 11.43,7.75 v11.56,7.62
FPGA_CAM_DPO  (via drill 0.2 pad 0.41)
  Top 0.193: U1.J11 39.09,25.8 v39.5,25.4 | J6.3 J6.18 6.56,5.06 6.29,5.33 6.29,5.91 6.73,6.35 8.13,6.35 8.76,6.99 8.76,7.68 8.95,7.87 9.27,7.87 v9.4,7.75 9.65,7.75 9.86,7.54 R98.2